# EAGLE schematic foxBMS_BMS-Slave_V1.00 (EAGLE 6.5.0), part 1 of 2
AUTHOR: Fraunhofer IISB foxBMS Team; REL-DATE: 2016-05-20; TITLE: foxBMS BMS-Slave; VERSION: 1.00

## Sheet 1 of 18: Overview
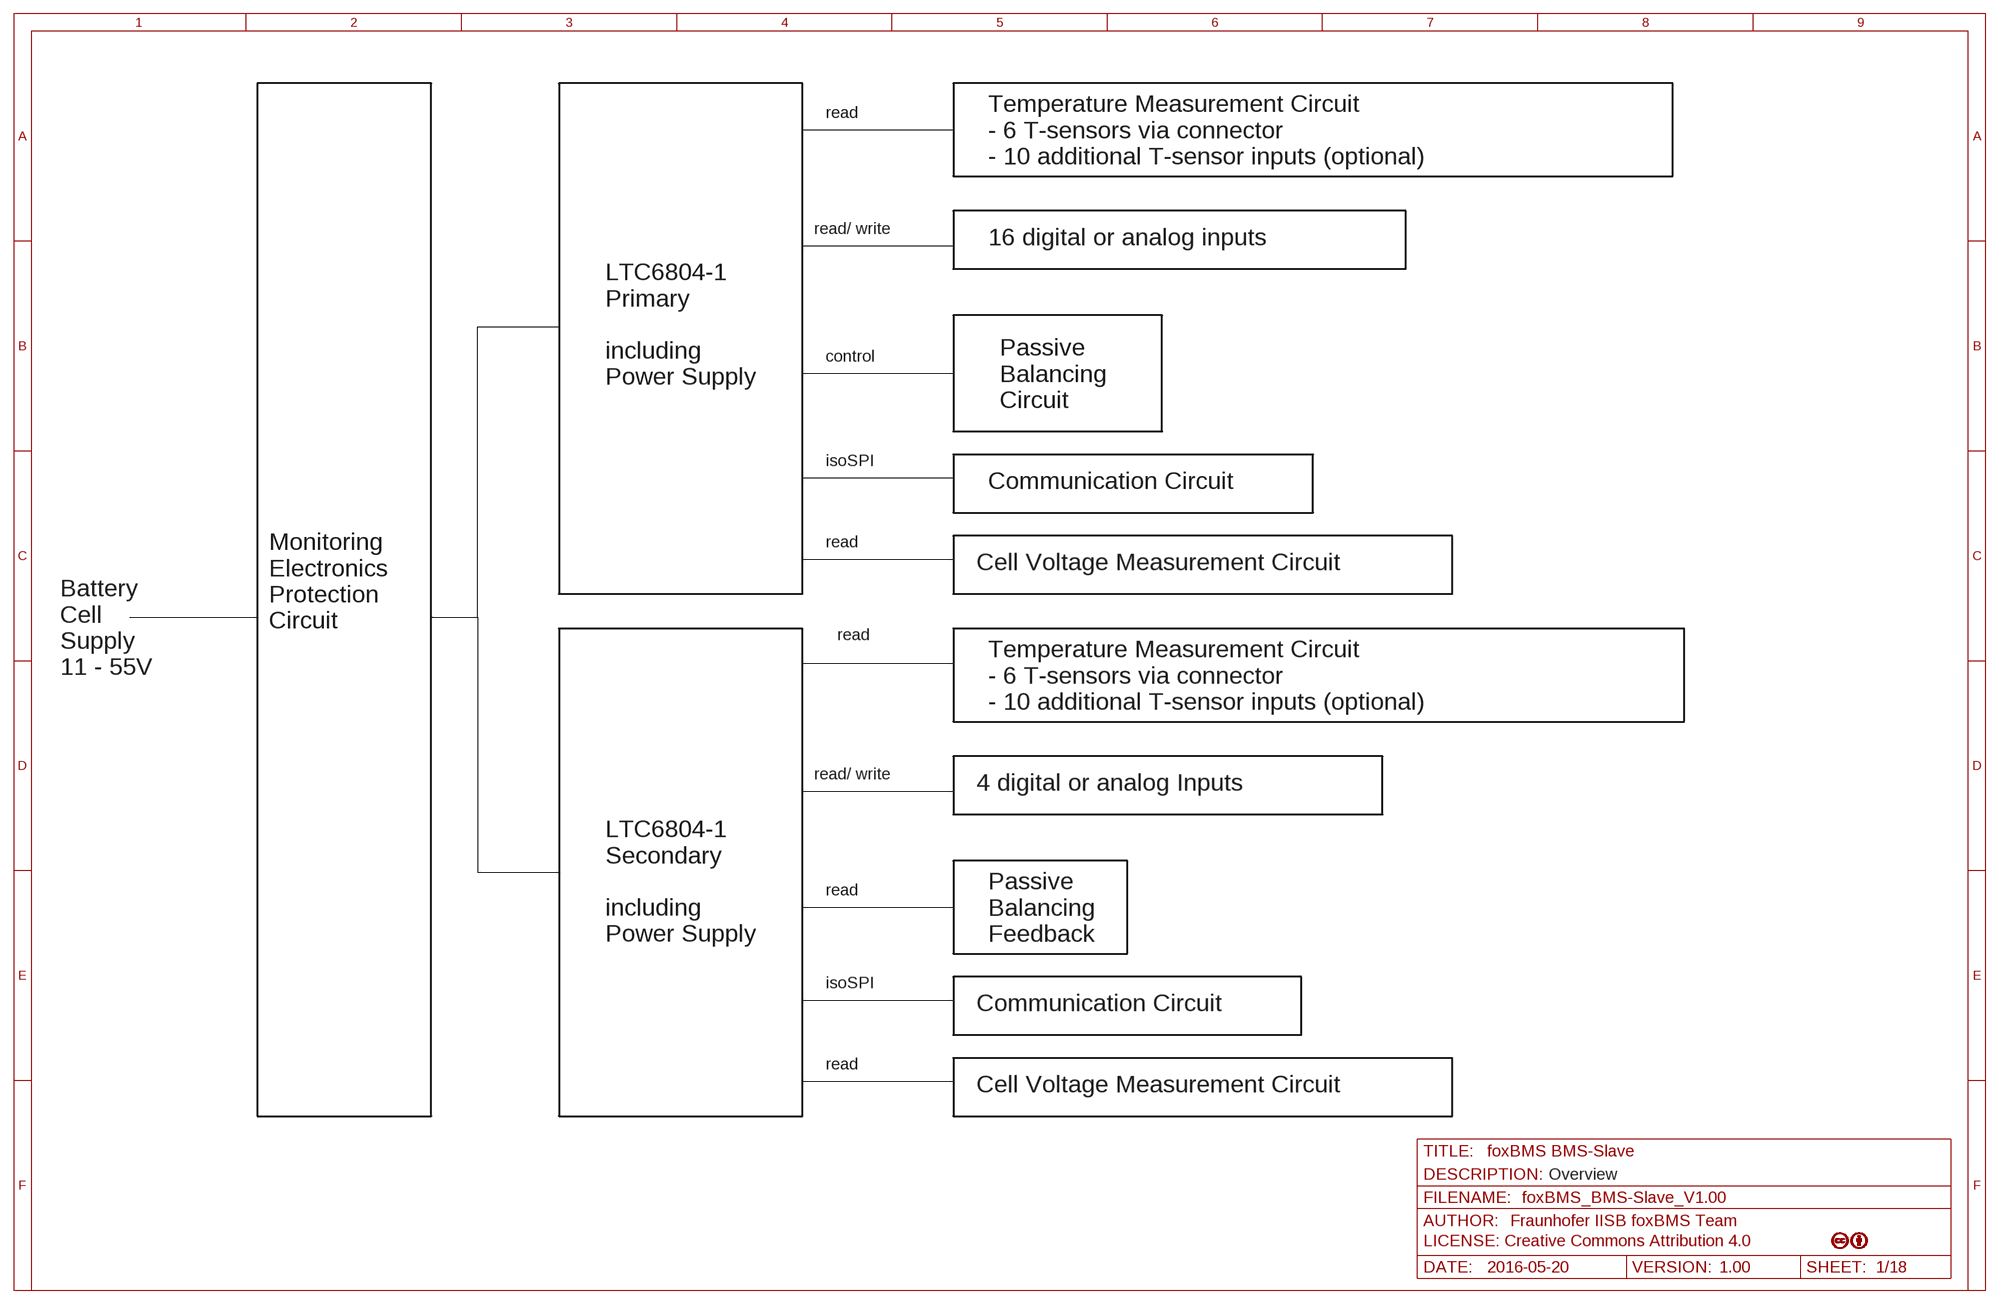
[diagram p0: schematic, sheet 1]

### Notes on the sheet
- read
- Temperature Measurement Circuit
  - 6 T-sensors via connector
  - 10 additional T-sensor inputs (optional)
- read/ write
- 16 digital or analog inputs
- control
- LTC6804-1
  Primary
  
  including 
  Power Supply
- Passive 
  Balancing 
  Circuit
- isoSPI
- Communication Circuit
- read
- Cell Voltage Measurement Circuit
- Monitoring 
  Electronics
  Protection 
  Circuit
- read
- Battery 
  Cell
  Supply
  11 - 55V
- Temperature Measurement Circuit
  - 6 T-sensors via connector
  - 10 additional T-sensor inputs (optional)
- read/ write
- 4 digital or analog Inputs
- read
- LTC6804-1
  Secondary
  
  including 
  Power Supply
- Passive 
  Balancing 
  Feedback
- isoSPI
- Communication Circuit
- read
- Cell Voltage Measurement Circuit
- Status: A
- Overview

## Sheet 2 of 18: Primary LTC6804
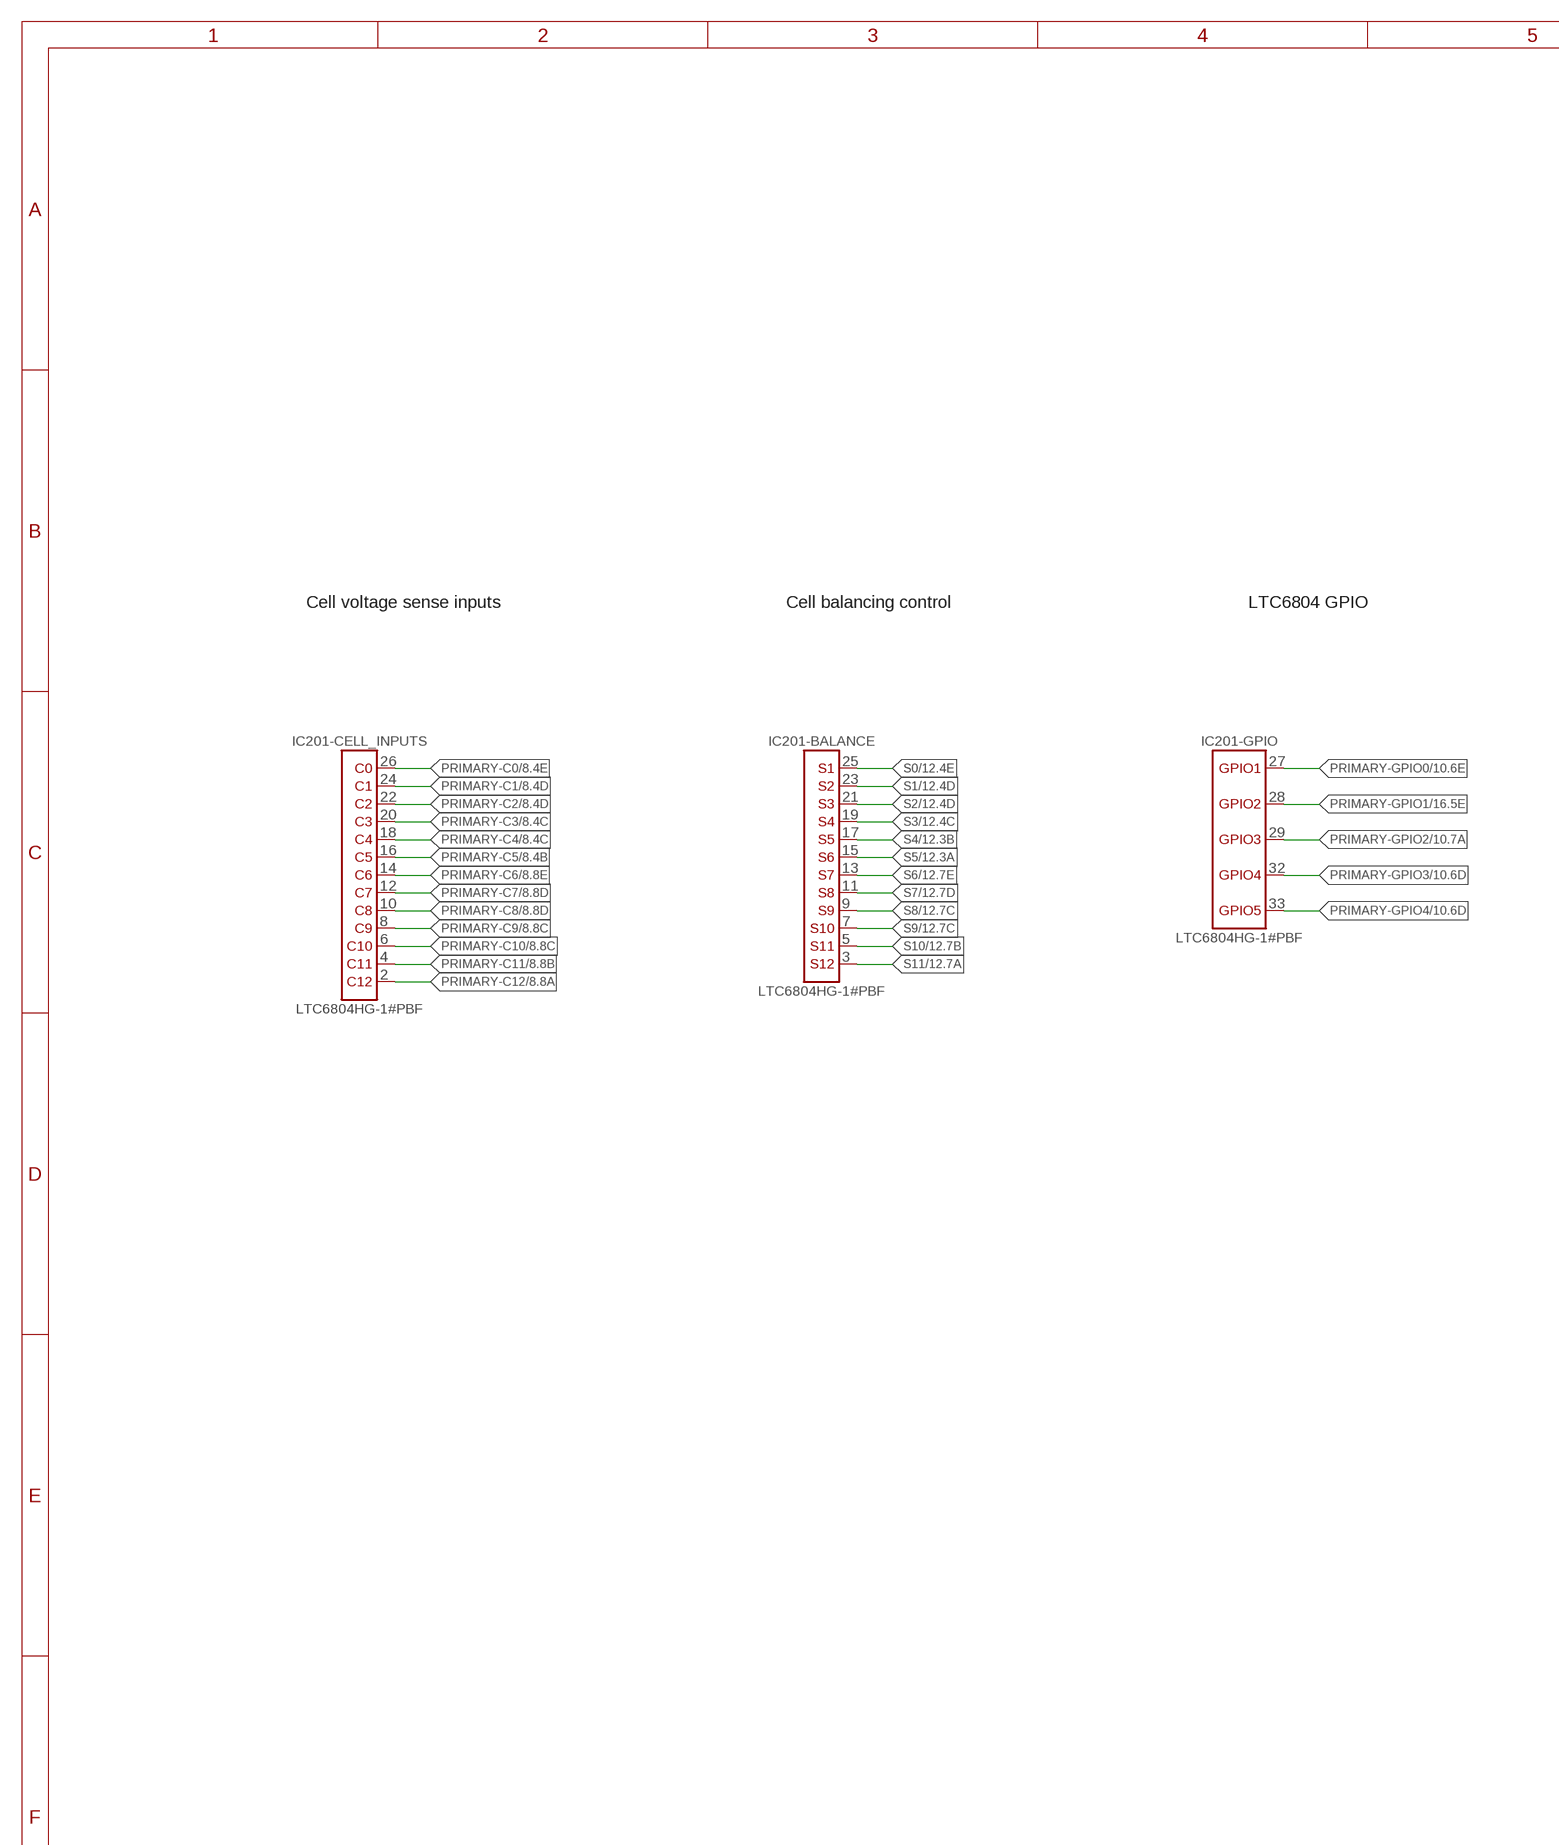
[diagram p1: schematic, sheet 2, part 1 of 2]
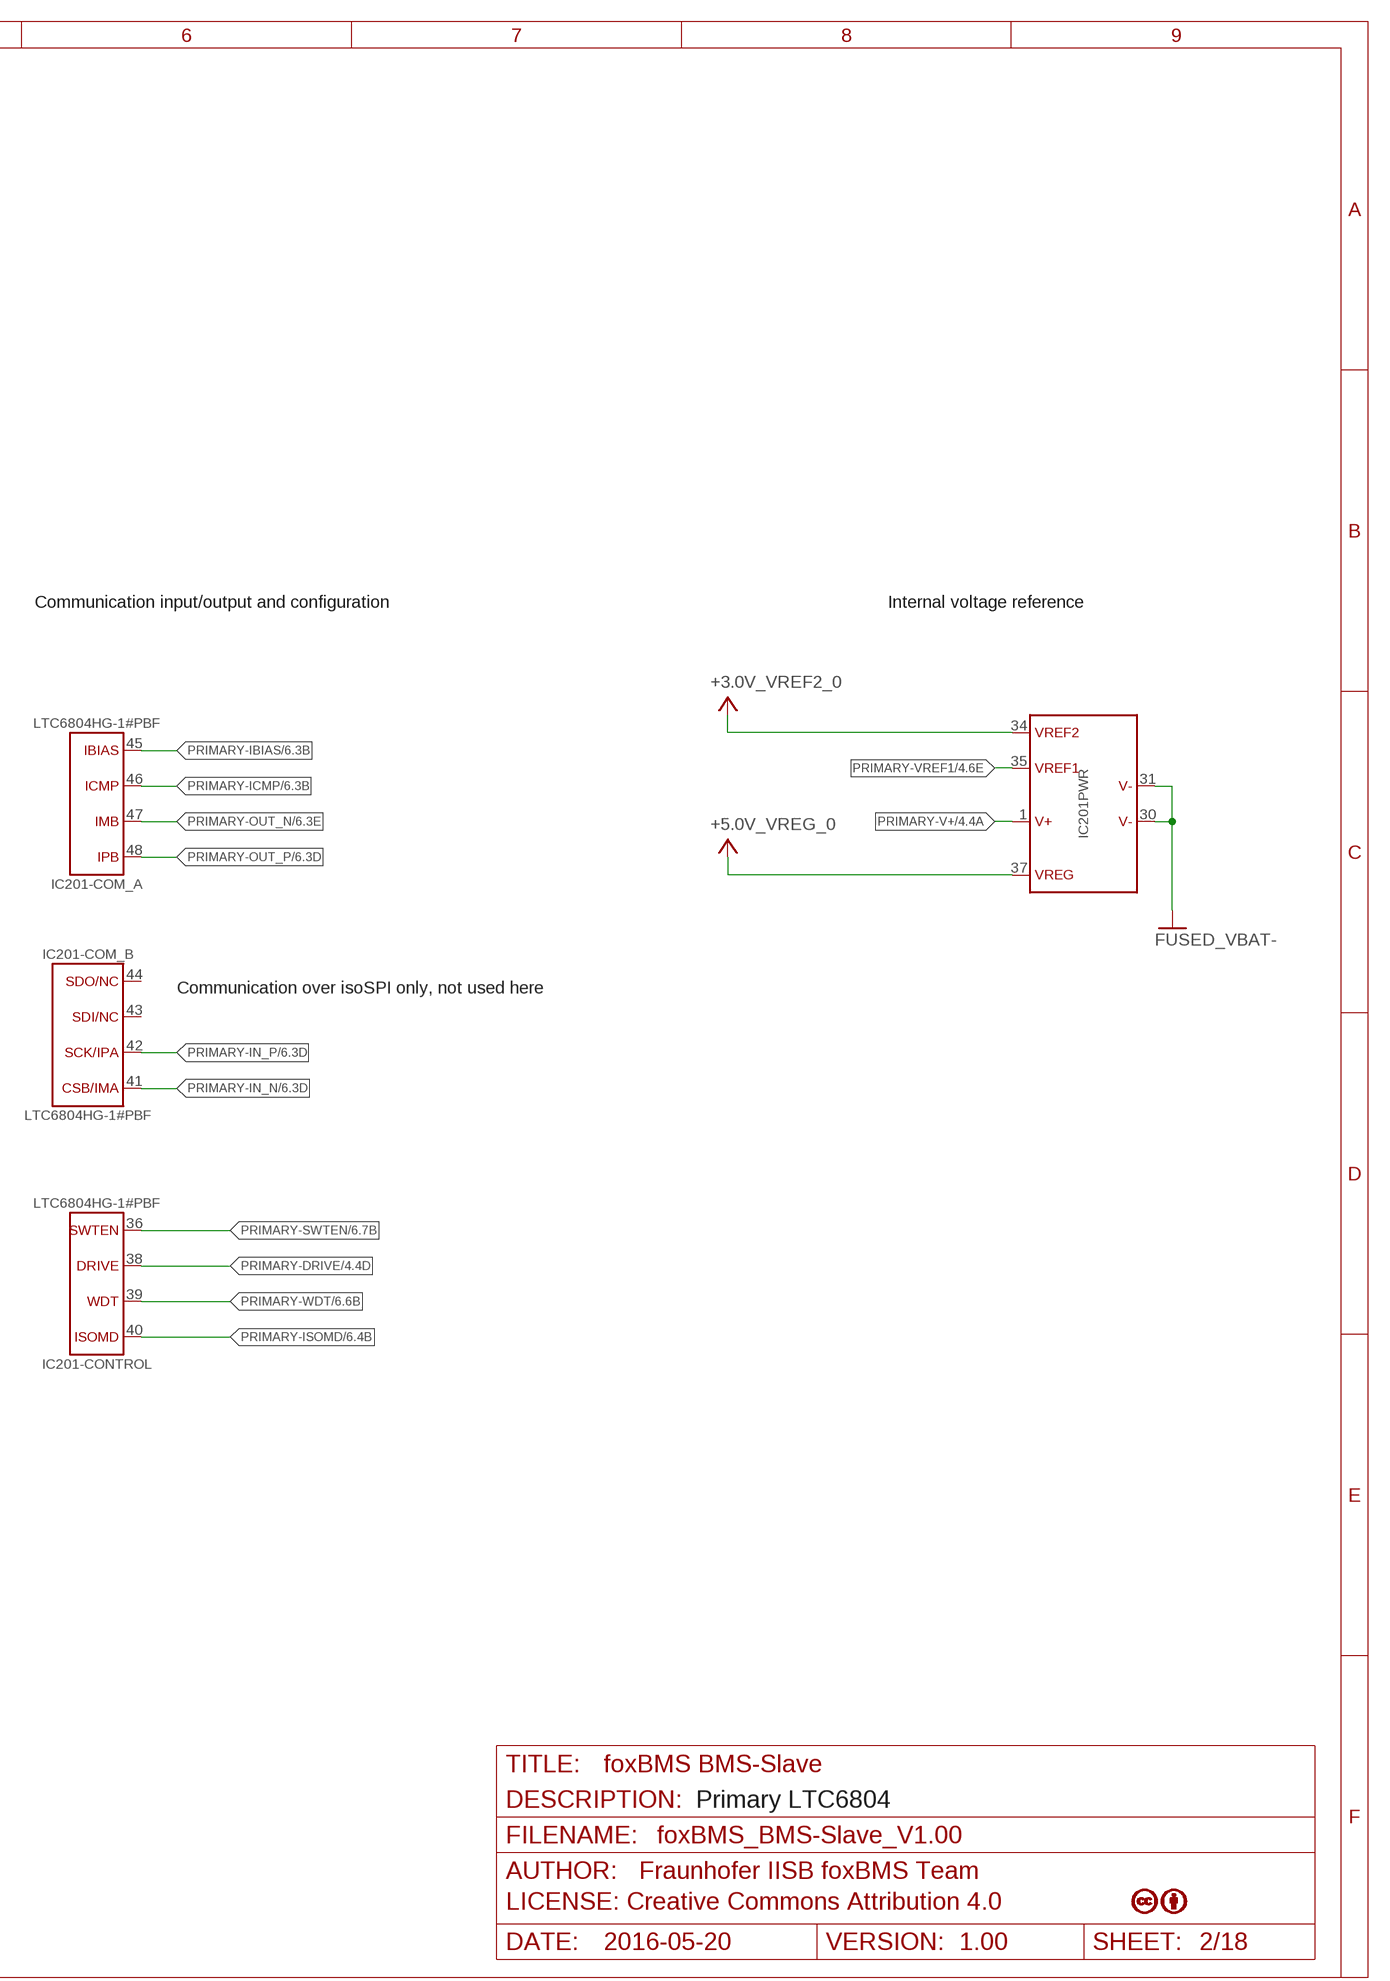
[diagram p2: schematic, sheet 2, part 2 of 2]

### Parts
IC201  LTC6804HG-1#PBF  [IC_SMD_SSOP-48_(G48)_R_LINEAR_REV01]

### Nets
+3.0V_VREF2_0: IC201.34(PWR:VREF2) ; also sheet 4,10,16
+5.0V_VREG_0: IC201.37(PWR:VREG) ; also sheet 4,6,10,13,16,17
FUSED_VBAT-: IC201.30(PWR:V-1) IC201.31(PWR:V-2) ; also sheet 3,4,5,6,7,8,9,10,11,12,13,14,15,16,17,18
PRIMARY-C0: IC201.26(-CELL_INPUTS:C0) ; also sheet 8
PRIMARY-C1: IC201.24(-CELL_INPUTS:C1) ; also sheet 8
PRIMARY-C2: IC201.22(-CELL_INPUTS:C2) ; also sheet 8
PRIMARY-C3: IC201.20(-CELL_INPUTS:C3) ; also sheet 8
PRIMARY-C4: IC201.18(-CELL_INPUTS:C4) ; also sheet 8
PRIMARY-C5: IC201.16(-CELL_INPUTS:C5) ; also sheet 8
PRIMARY-C6: IC201.14(-CELL_INPUTS:C6) ; also sheet 8
PRIMARY-C7: IC201.12(-CELL_INPUTS:C7) ; also sheet 8
PRIMARY-C8: IC201.10(-CELL_INPUTS:C8) ; also sheet 8
PRIMARY-C9: IC201.8(-CELL_INPUTS:C9) ; also sheet 8
PRIMARY-C10: IC201.6(-CELL_INPUTS:C10) ; also sheet 8
PRIMARY-C11: IC201.4(-CELL_INPUTS:C11) ; also sheet 8
PRIMARY-C12: IC201.2(-CELL_INPUTS:C12) ; also sheet 8
PRIMARY-DRIVE: IC201.38(-CONTROL:DRIVE) ; also sheet 4
PRIMARY-GPIO0: IC201.27(-GPIO:GPIO1) ; also sheet 10
PRIMARY-GPIO1: IC201.28(-GPIO:GPIO2) ; also sheet 16
PRIMARY-GPIO2: IC201.29(-GPIO:GPIO3) ; also sheet 10,16
PRIMARY-GPIO3: IC201.32(-GPIO:GPIO4) ; also sheet 10
PRIMARY-GPIO4: IC201.33(-GPIO:GPIO5) ; also sheet 10
PRIMARY-IBIAS: IC201.45(-COM_A:IBIAS) ; also sheet 6
PRIMARY-ICMP: IC201.46(-COM_A:ICMP) ; also sheet 6
PRIMARY-IN_N: IC201.41(-COM_B:CSB/IMA) ; also sheet 6
PRIMARY-IN_P: IC201.42(-COM_B:SCK/IPA) ; also sheet 6
PRIMARY-ISOMD: IC201.40(-CONTROL:ISOMD) ; also sheet 6
PRIMARY-OUT_N: IC201.47(-COM_A:IMB) ; also sheet 6
PRIMARY-OUT_P: IC201.48(-COM_A:IPB) ; also sheet 6
PRIMARY-SWTEN: IC201.36(-CONTROL:SWTEN) ; also sheet 6
PRIMARY-V+: IC201.1(PWR:V+) ; also sheet 4
PRIMARY-VREF1: IC201.35(PWR:VREF1) ; also sheet 4
PRIMARY-WDT: IC201.39(-CONTROL:WDT) ; also sheet 6,16
S0: IC201.25(-BALANCE:S1) ; also sheet 12
S1: IC201.23(-BALANCE:S2) ; also sheet 12
S2: IC201.21(-BALANCE:S3) ; also sheet 12
S3: IC201.19(-BALANCE:S4) ; also sheet 12
S4: IC201.17(-BALANCE:S5) ; also sheet 12
S5: IC201.15(-BALANCE:S6) ; also sheet 12
S6: IC201.13(-BALANCE:S7) ; also sheet 12
S7: IC201.11(-BALANCE:S8) ; also sheet 12
S8: IC201.9(-BALANCE:S9) ; also sheet 12
S9: IC201.7(-BALANCE:S10) ; also sheet 12
S10: IC201.5(-BALANCE:S11) ; also sheet 12
S11: IC201.3(-BALANCE:S12) ; also sheet 12
Unconnected: IC201.43(-COM_B:SDI/NC) IC201.44(-COM_B:SDO/NC)

### Notes on the sheet
- Cell voltage sense inputs | Cell balancing control | LTC6804 GPIO | Communication input/output and configuration | Internal voltage reference
- Communication over isoSPI only, not used here
- Status: A
- Primary LTC6804

## Sheet 3 of 18: Secondary LTC6804
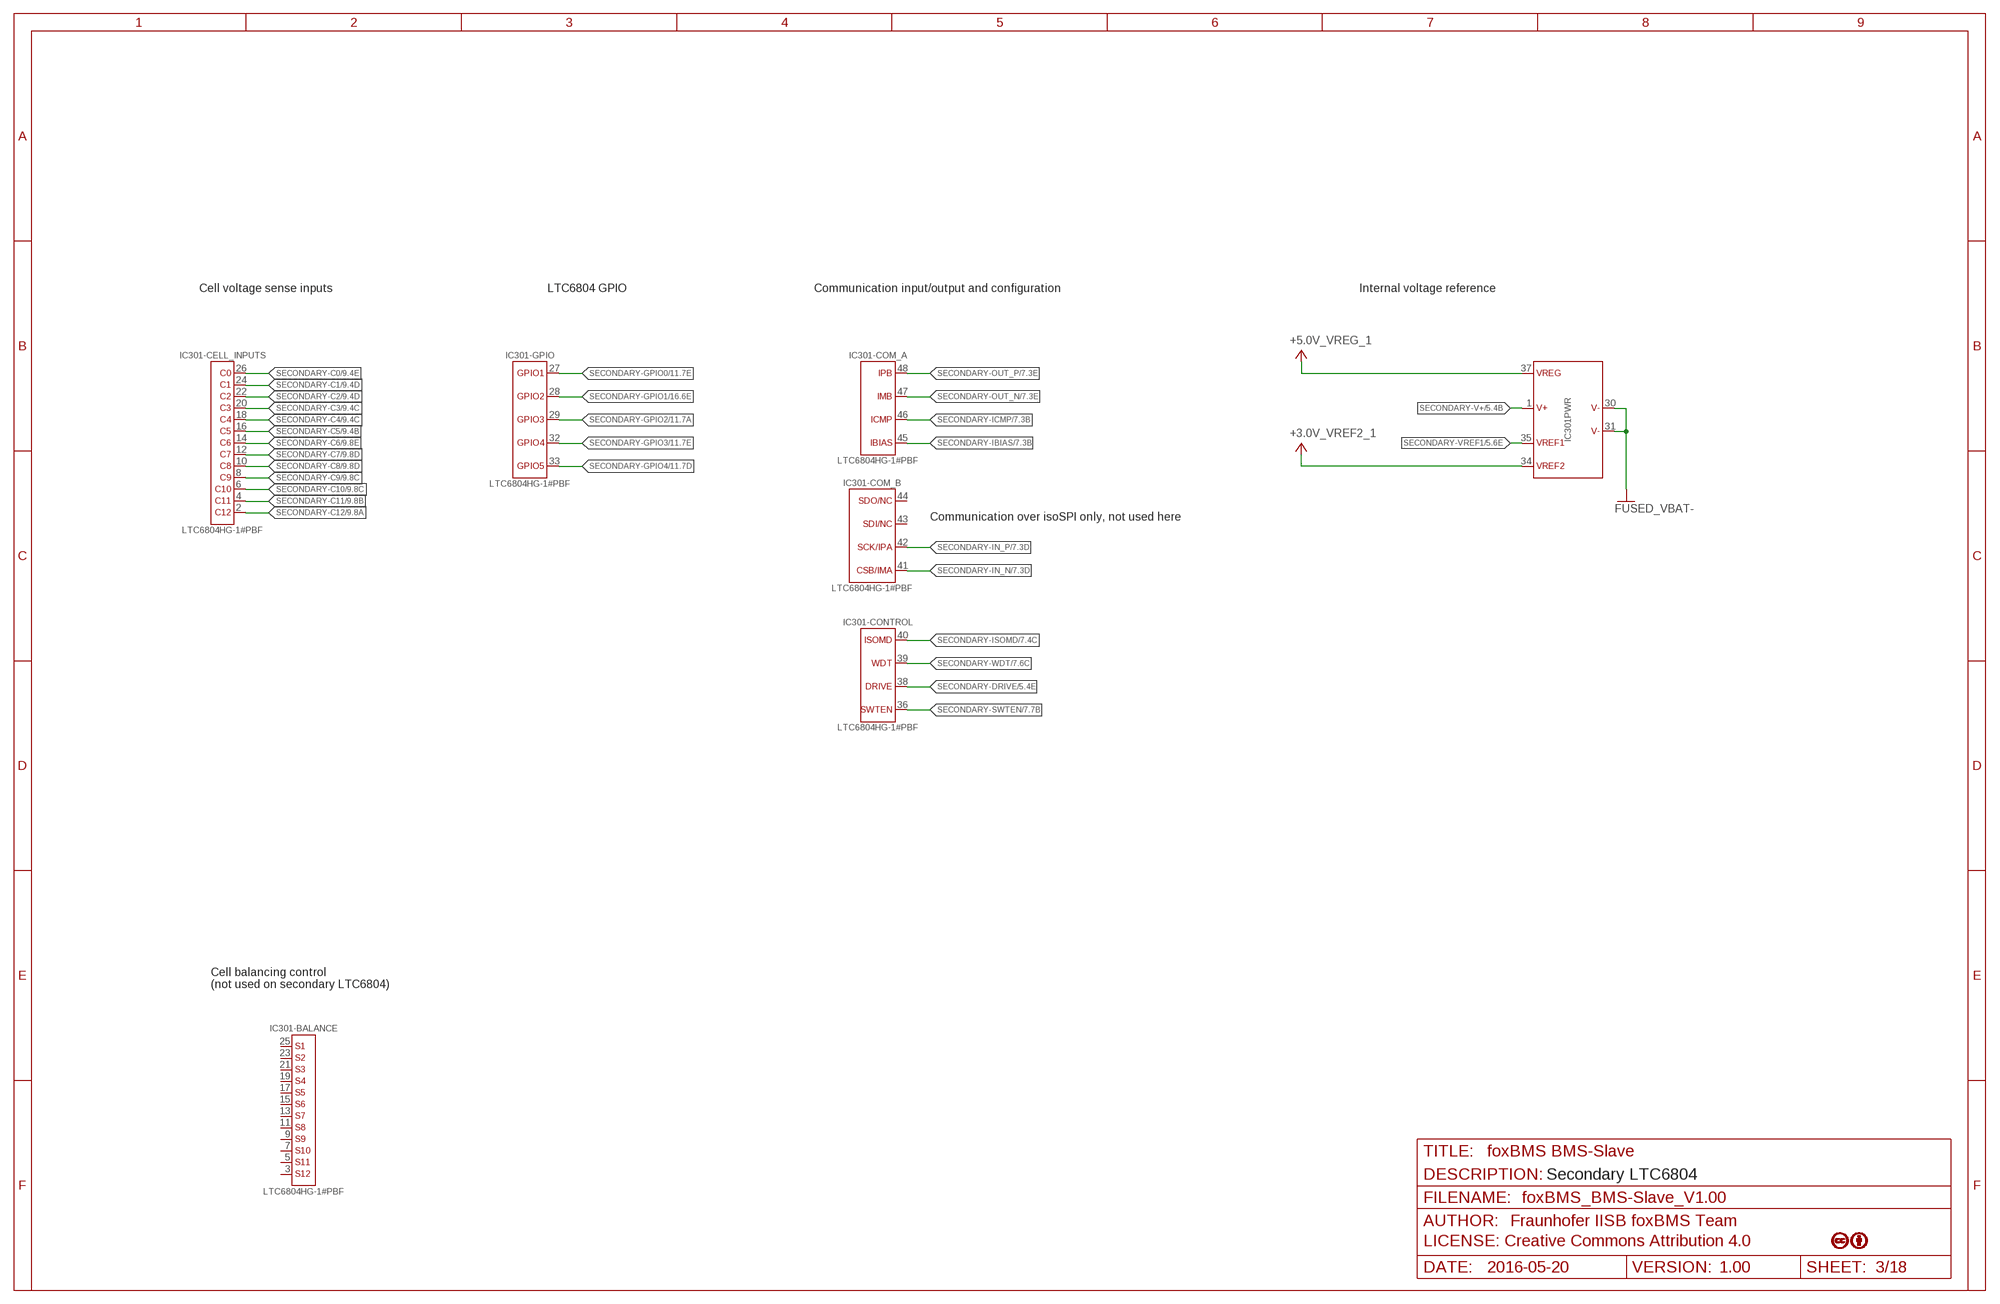
[diagram p3: schematic, sheet 3]

### Parts
IC301  LTC6804HG-1#PBF  [IC_SMD_SSOP-48_(G48)_R_LINEAR_REV01]

### Nets
+3.0V_VREF2_1: IC301.34(PWR:VREF2) ; also sheet 5,11,16
+5.0V_VREG_1: IC301.37(PWR:VREG) ; also sheet 5,7,11,14,16,18
FUSED_VBAT-: IC301.30(PWR:V-1) IC301.31(PWR:V-2) ; also sheet 2,4,5,6,7,8,9,10,11,12,13,14,15,16,17,18
SECONDARY-C0: IC301.26(-CELL_INPUTS:C0) ; also sheet 9
SECONDARY-C1: IC301.24(-CELL_INPUTS:C1) ; also sheet 9
SECONDARY-C2: IC301.22(-CELL_INPUTS:C2) ; also sheet 9
SECONDARY-C3: IC301.20(-CELL_INPUTS:C3) ; also sheet 9
SECONDARY-C4: IC301.18(-CELL_INPUTS:C4) ; also sheet 9
SECONDARY-C5: IC301.16(-CELL_INPUTS:C5) ; also sheet 9
SECONDARY-C6: IC301.14(-CELL_INPUTS:C6) ; also sheet 9
SECONDARY-C7: IC301.12(-CELL_INPUTS:C7) ; also sheet 9
SECONDARY-C8: IC301.10(-CELL_INPUTS:C8) ; also sheet 9
SECONDARY-C9: IC301.8(-CELL_INPUTS:C9) ; also sheet 9
SECONDARY-C10: IC301.6(-CELL_INPUTS:C10) ; also sheet 9
SECONDARY-C11: IC301.4(-CELL_INPUTS:C11) ; also sheet 9
SECONDARY-C12: IC301.2(-CELL_INPUTS:C12) ; also sheet 9
SECONDARY-DRIVE: IC301.38(-CONTROL:DRIVE) ; also sheet 5
SECONDARY-GPIO0: IC301.27(-GPIO:GPIO1) ; also sheet 11
SECONDARY-GPIO1: IC301.28(-GPIO:GPIO2) ; also sheet 16
SECONDARY-GPIO2: IC301.29(-GPIO:GPIO3) ; also sheet 11,16
SECONDARY-GPIO3: IC301.32(-GPIO:GPIO4) ; also sheet 11
SECONDARY-GPIO4: IC301.33(-GPIO:GPIO5) ; also sheet 11
SECONDARY-IBIAS: IC301.45(-COM_A:IBIAS) ; also sheet 7
SECONDARY-ICMP: IC301.46(-COM_A:ICMP) ; also sheet 7
SECONDARY-IN_N: IC301.41(-COM_B:CSB/IMA) ; also sheet 7
SECONDARY-IN_P: IC301.42(-COM_B:SCK/IPA) ; also sheet 7
SECONDARY-ISOMD: IC301.40(-CONTROL:ISOMD) ; also sheet 7
SECONDARY-OUT_N [DiffPair]: IC301.47(-COM_A:IMB) ; also sheet 7
SECONDARY-OUT_P [DiffPair]: IC301.48(-COM_A:IPB) ; also sheet 7
SECONDARY-SWTEN: IC301.36(-CONTROL:SWTEN) ; also sheet 7
SECONDARY-V+: IC301.1(PWR:V+) ; also sheet 5
SECONDARY-VREF1: IC301.35(PWR:VREF1) ; also sheet 5
SECONDARY-WDT: IC301.39(-CONTROL:WDT) ; also sheet 7,16
Unconnected: IC301.3(-BALANCE:S12) IC301.5(-BALANCE:S11) IC301.7(-BALANCE:S10) IC301.9(-BALANCE:S9) IC301.11(-BALANCE:S8) IC301.13(-BALANCE:S7) IC301.15(-BALANCE:S6) IC301.17(-BALANCE:S5) IC301.19(-BALANCE:S4) IC301.21(-BALANCE:S3) IC301.23(-BALANCE:S2) IC301.25(-BALANCE:S1) IC301.43(-COM_B:SDI/NC) IC301.44(-COM_B:SDO/NC)

### Notes on the sheet
- Cell voltage sense inputs | LTC6804 GPIO | Communication input/output and configuration | Internal voltage reference
- Communication over isoSPI only, not used here
- Cell balancing control
  (not used on secondary LTC6804)
- Status: A
- Secondary LTC6804

## Sheet 4 of 18: Primary Supply Circuit
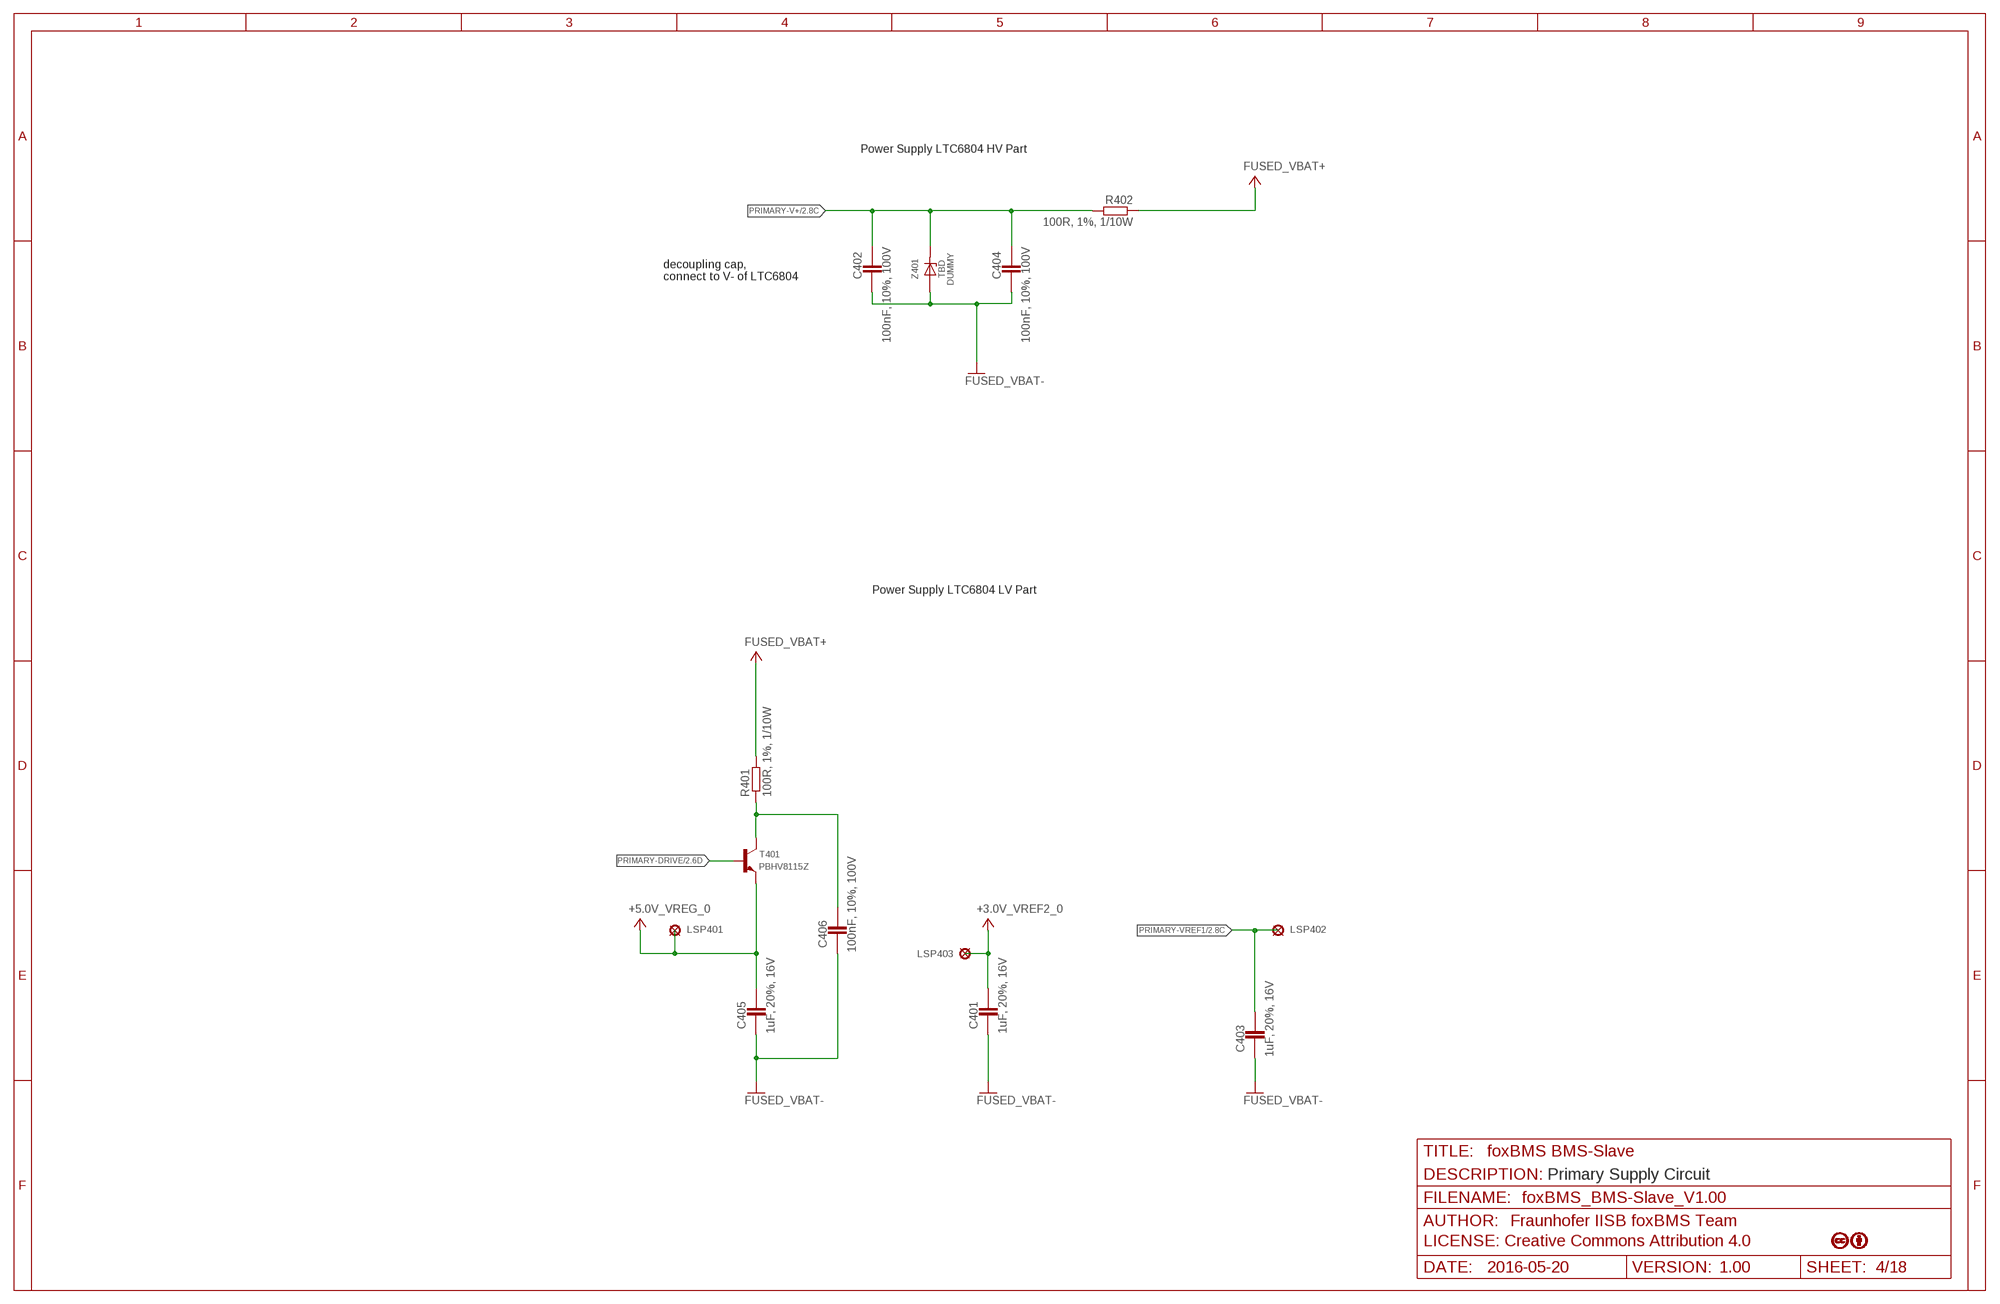
[diagram p4: schematic, sheet 4]

### Parts
C401  1uF, 20%, 16V  C_NP0_0603  [0603]
C402  100nF, 10%, 100V  C_NP0_0805  [0805]
C403  1uF, 20%, 16V  C_NP0_0603  [0603]
C404  100nF, 10%, 100V  C_NP0_0805  [0805]
C405  1uF, 20%, 16V  C_NP0_0603  [0603]
C406  100nF, 10%, 100V  C_NP0_0805  [0805]
LSP401  PAD_2.0X1.5MM  [PAD2.0X1.5MM]
LSP402  PAD_2.0X1.5MM  [PAD2.0X1.5MM]
LSP403  PAD_2.0X1.5MM  [PAD2.0X1.5MM]
R401  100R, 1%, 1/10W  R_MET_0603  [0603]
R402  100R, 1%, 1/10W  R_MET_0603  [0603]
T401  PBHV8115Z  [D_SMD_SOT223_(SC-73)_R_NXP_REV01]
Z401  60V,500mW  MMSZ4XXX_T1G-DUMMY  [D_SMD_SOD-123_R_ON_REV01]

### Nets
+3.0V_VREF2_0: C401.2 LSP403.P$1(MP) ; also sheet 2,10,16
+5.0V_VREG_0: C405.2 LSP401.P$1(MP) T401.3(E) ; also sheet 2,6,10,13,16,17
FUSED_VBAT+: R401.2 R402.1 ; also sheet 5,15
FUSED_VBAT-: C401.1 C402.2 C403.1 C404.2 C405.1 C406.1 Z401.A ; also sheet 2,3,5,6,7,8,9,10,11,12,13,14,15,16,17,18
N$5: C406.2 R401.1 T401.2(C) T401.4(C)
PRIMARY-DRIVE: T401.1(B) ; also sheet 2
PRIMARY-V+: C402.1 C404.1 R402.2 Z401.K(C) ; also sheet 2
PRIMARY-VREF1: C403.2 LSP402.P$1(MP) ; also sheet 2

### Notes on the sheet
- Power Supply LTC6804 HV Part
- decoupling cap, 
  connect to V- of LTC6804
- Power Supply LTC6804 LV Part
- Status: A
- Primary Supply Circuit

## Sheet 5 of 18: Secondary Supply Circuit
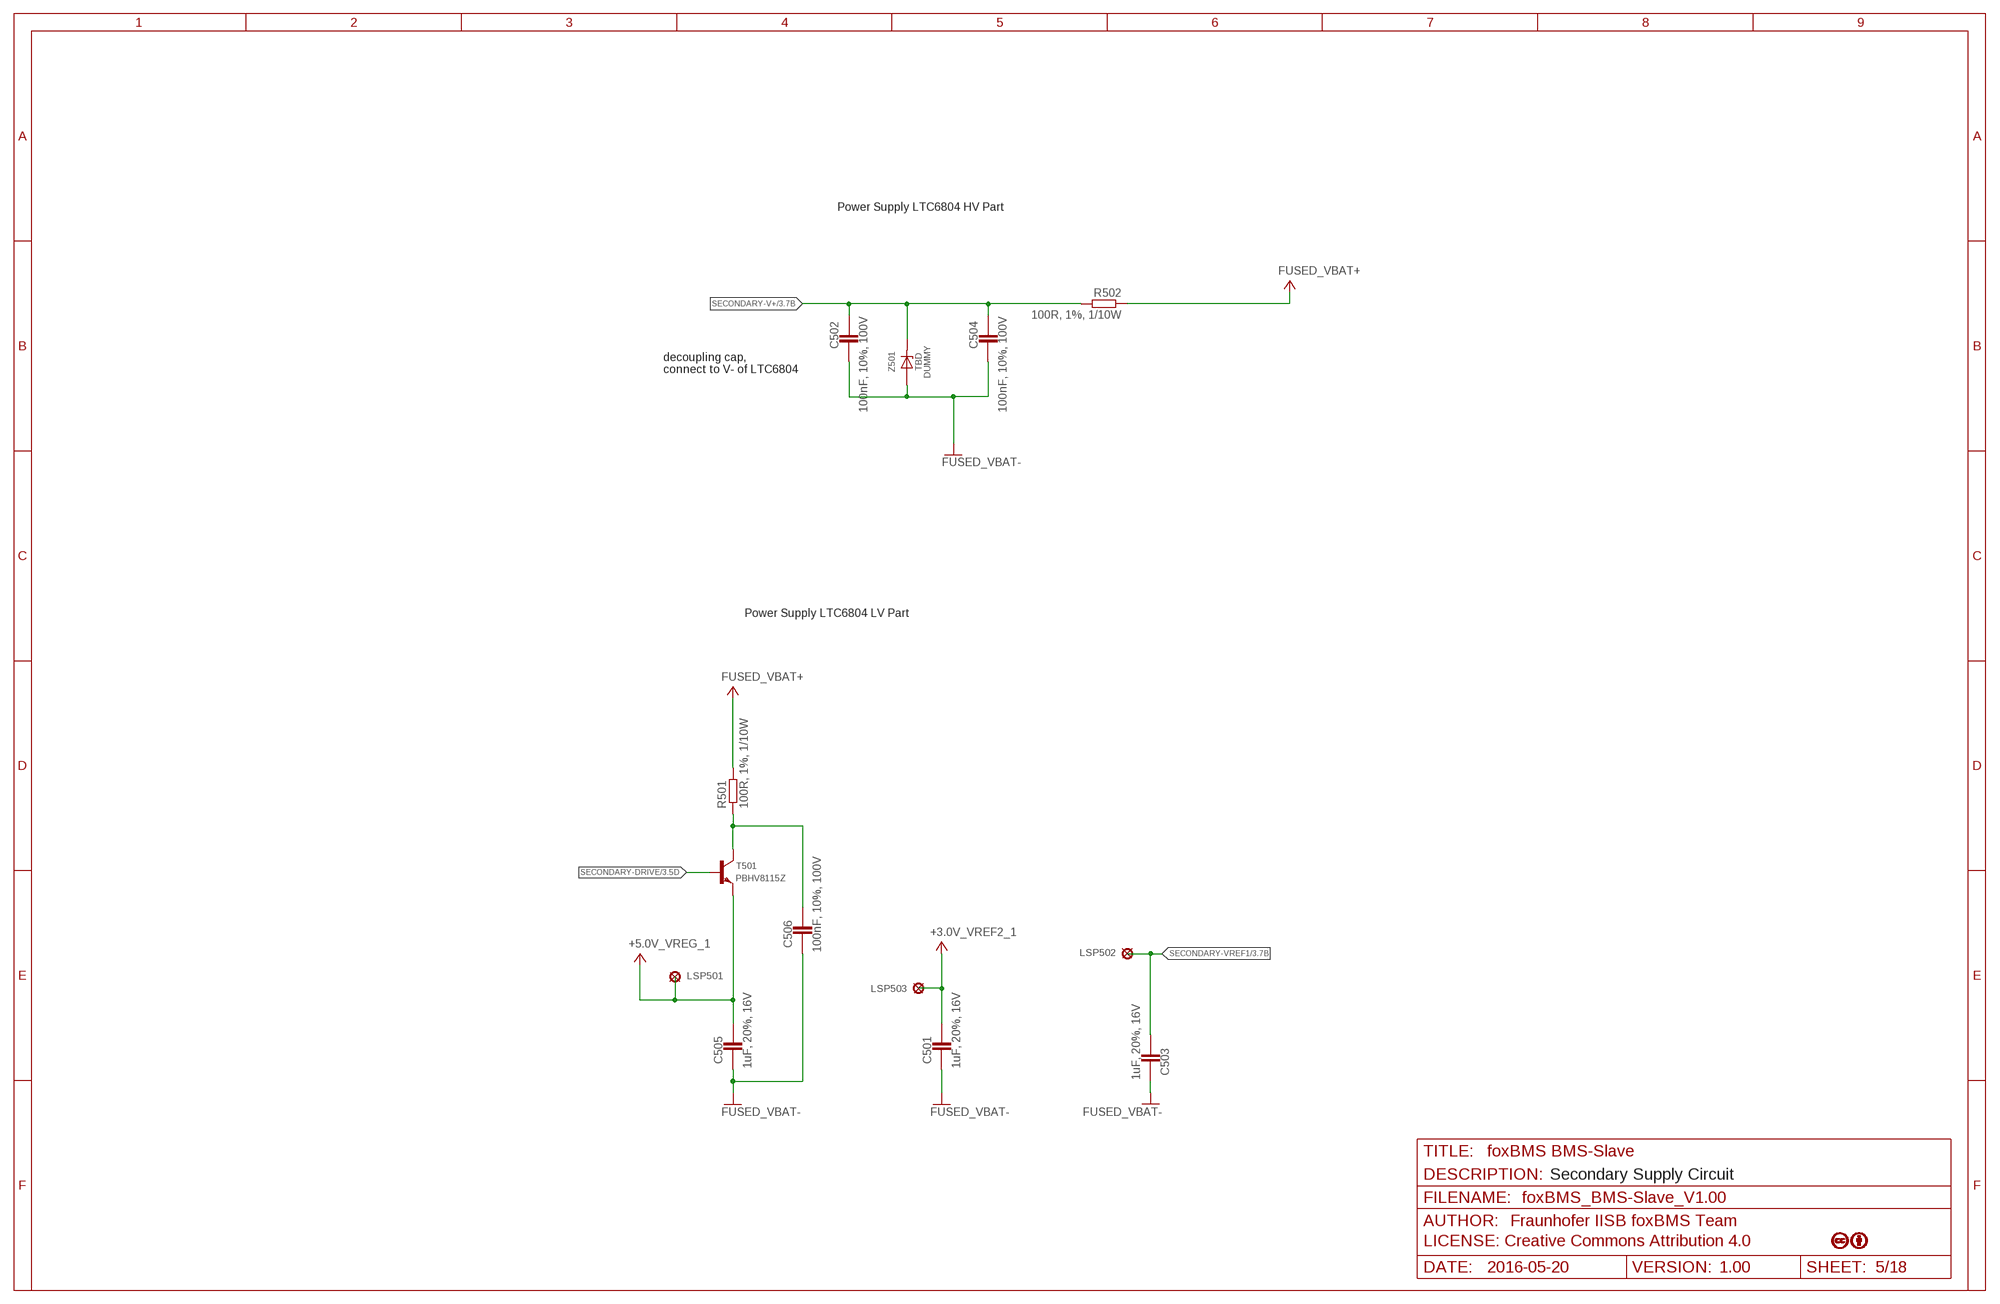
[diagram p5: schematic, sheet 5]

### Parts
C501  1uF, 20%, 16V  C_NP0_0603  [0603]
C502  100nF, 10%, 100V  C_NP0_0805  [0805]
C503  1uF, 20%, 16V  C_NP0_0603  [0603]
C504  100nF, 10%, 100V  C_NP0_0805  [0805]
C505  1uF, 20%, 16V  C_NP0_0603  [0603]
C506  100nF, 10%, 100V  C_NP0_0805  [0805]
LSP501  PAD_2.0X1.5MM  [PAD2.0X1.5MM]
LSP502  PAD_2.0X1.5MM  [PAD2.0X1.5MM]
LSP503  PAD_2.0X1.5MM  [PAD2.0X1.5MM]
R501  100R, 1%, 1/10W  R_MET_0603  [0603]
R502  100R, 1%, 1/10W  R_MET_0603  [0603]
T501  PBHV8115Z  [D_SMD_SOT223_(SC-73)_R_NXP_REV01]
Z501  60V,500mW  MMSZ4XXX_T1G-DUMMY  [D_SMD_SOD-123_R_ON_REV01]

### Nets
+3.0V_VREF2_1: C501.2 LSP503.P$1(MP) ; also sheet 3,11,16
+5.0V_VREG_1: C505.2 LSP501.P$1(MP) T501.3(E) ; also sheet 3,7,11,14,16,18
FUSED_VBAT+: R501.2 R502.1 ; also sheet 4,15
FUSED_VBAT-: C501.1 C502.2 C503.1 C504.2 C505.1 C506.1 Z501.A ; also sheet 2,3,4,6,7,8,9,10,11,12,13,14,15,16,17,18
N$13: C506.2 R501.1 T501.2(C) T501.4(C)
SECONDARY-DRIVE: T501.1(B) ; also sheet 3
SECONDARY-V+: C502.1 C504.1 R502.2 Z501.K(C) ; also sheet 3
SECONDARY-VREF1: C503.2 LSP502.P$1(MP) ; also sheet 3

### Notes on the sheet
- Power Supply LTC6804 HV Part
- decoupling cap, 
  connect to V- of LTC6804
- Power Supply LTC6804 LV Part
- Status: A
- Secondary Supply Circuit

## Sheet 6 of 18: Primary Communication Circuit
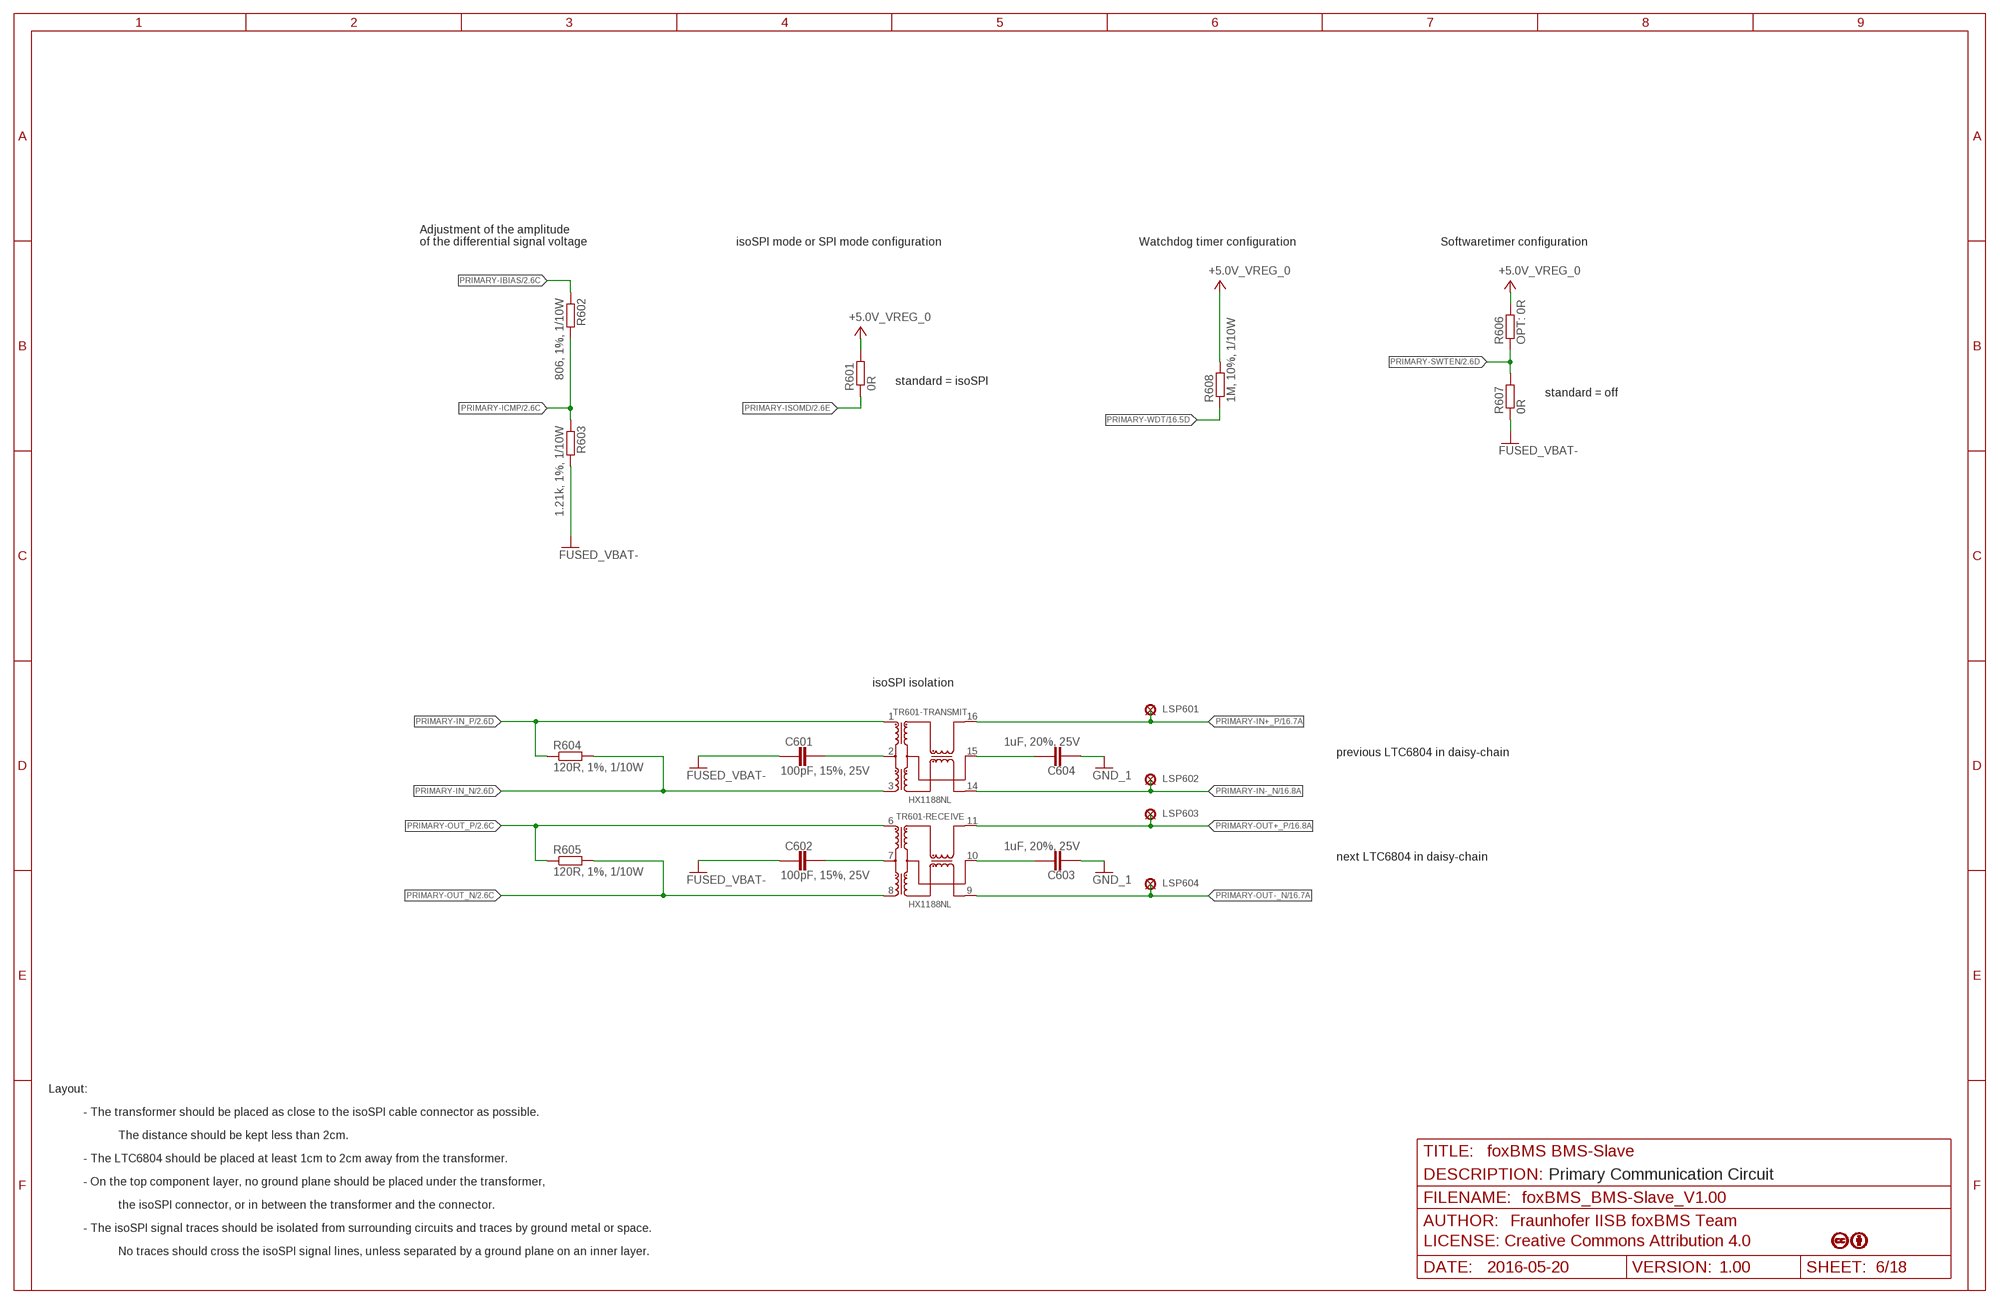
[diagram p6: schematic, sheet 6]

### Parts
C601  100pF, 15%, 25V  C_NP0_0603  [0603]
C602  100pF, 15%, 25V  C_NP0_0603  [0603]
C603  1uF, 20%, 25V  C_NP0_0603  [0603]
C604  1uF, 20%, 25V  C_NP0_0603  [0603]
LSP601  PAD_2.0X1.5MM  [PAD2.0X1.5MM]
LSP602  PAD_2.0X1.5MM  [PAD2.0X1.5MM]
LSP603  PAD_2.0X1.5MM  [PAD2.0X1.5MM]
LSP604  PAD_2.0X1.5MM  [PAD2.0X1.5MM]
R601  0R  R_MET_0603  [0603]
R602  806, 1%, 1/10W  R_MET_0603  [0603]
R603  1.21k, 1%, 1/10W  R_MET_0603  [0603]
R604  120R, 1%, 1/10W  R_MET_0603  [0603]
R605  120R, 1%, 1/10W  R_MET_0603  [0603]
R606  OPT: 0R  R_MET_0603  [0603]
R607  0R  R_MET_0603  [0603]
R608  1M, 10%, 1/10W  R_MET_0603  [0603]
TR601  HX1188NL  [TR_SMD_SOIC-16_(12,70MMX9,53MMX5,97MM)_R_PULSE_REV01]

### Nets
+5.0V_VREG_0: R601.2 R606.2 R608.2 ; also sheet 2,4,10,13,16,17
FUSED_VBAT-: C601.1 C602.1 R603.2 R607.1 ; also sheet 2,3,4,5,7,8,9,10,11,12,13,14,15,16,17,18
GND_1: C603.1 C604.1 ; also sheet 7
N$10: C601.2 TR601.2(-TRANSMIT:CT)
N$12: C602.2 TR601.7(-RECEIVE:CT)
N$18: C604.2 TR601.15(-TRANSMIT:CMT)
N$23: C603.2 TR601.10(-RECEIVE:CMT)
PRIMARY-IBIAS: R602.1 ; also sheet 2
PRIMARY-ICMP: R602.2 R603.1 ; also sheet 2
PRIMARY-IN+_P: LSP601.P$1(MP) TR601.16(-TRANSMIT:X+) ; also sheet 16
PRIMARY-IN-_N: LSP602.P$1(MP) TR601.14(-TRANSMIT:X-) ; also sheet 16
PRIMARY-IN_N: R604.2 TR601.3(-TRANSMIT:D-) ; also sheet 2
PRIMARY-IN_P: R604.1 TR601.1(-TRANSMIT:D+) ; also sheet 2
PRIMARY-ISOMD: R601.1 ; also sheet 2
PRIMARY-OUT+_P: LSP603.P$1(MP) TR601.11(-RECEIVE:X+) ; also sheet 16
PRIMARY-OUT-_N: LSP604.P$1(MP) TR601.9(-RECEIVE:X-) ; also sheet 16
PRIMARY-OUT_N: R605.2 TR601.8(-RECEIVE:D-) ; also sheet 2
PRIMARY-OUT_P: R605.1 TR601.6(-RECEIVE:D+) ; also sheet 2
PRIMARY-SWTEN: R606.1 R607.2 ; also sheet 2
PRIMARY-WDT: R608.1 ; also sheet 2,16
Unconnected: TR601.4(NC1:NC) TR601.5(NC2:NC) TR601.12(NC3:NC) TR601.13(NC4:NC)

### Notes on the sheet
- Adjustment of the amplitude
  of the differential signal voltage
- isoSPI mode or SPI mode configuration | Watchdog timer configuration | Softwaretimer configuration
- standard = isoSPI
- standard = off
- isoSPI isolation
- previous LTC6804 in daisy-chain
- next LTC6804 in daisy-chain
- Layout:
- - The transformer should be placed as close to the isoSPI cable connector as possible.
- The distance should be kept less than 2cm.
- - The LTC6804 should be placed at least 1cm to 2cm away from the transformer.
- Status: A
- Primary Communication Circuit
- - On the top component layer, no ground plane should be placed under the transformer,
- the isoSPI connector, or in between the transformer and the connector.
- - The isoSPI signal traces should be isolated from surrounding circuits and traces by ground metal or space.
- No traces should cross the isoSPI signal lines, unless separated by a ground plane on an inner layer.

## Sheet 7 of 18: Secondary Communication Circuit
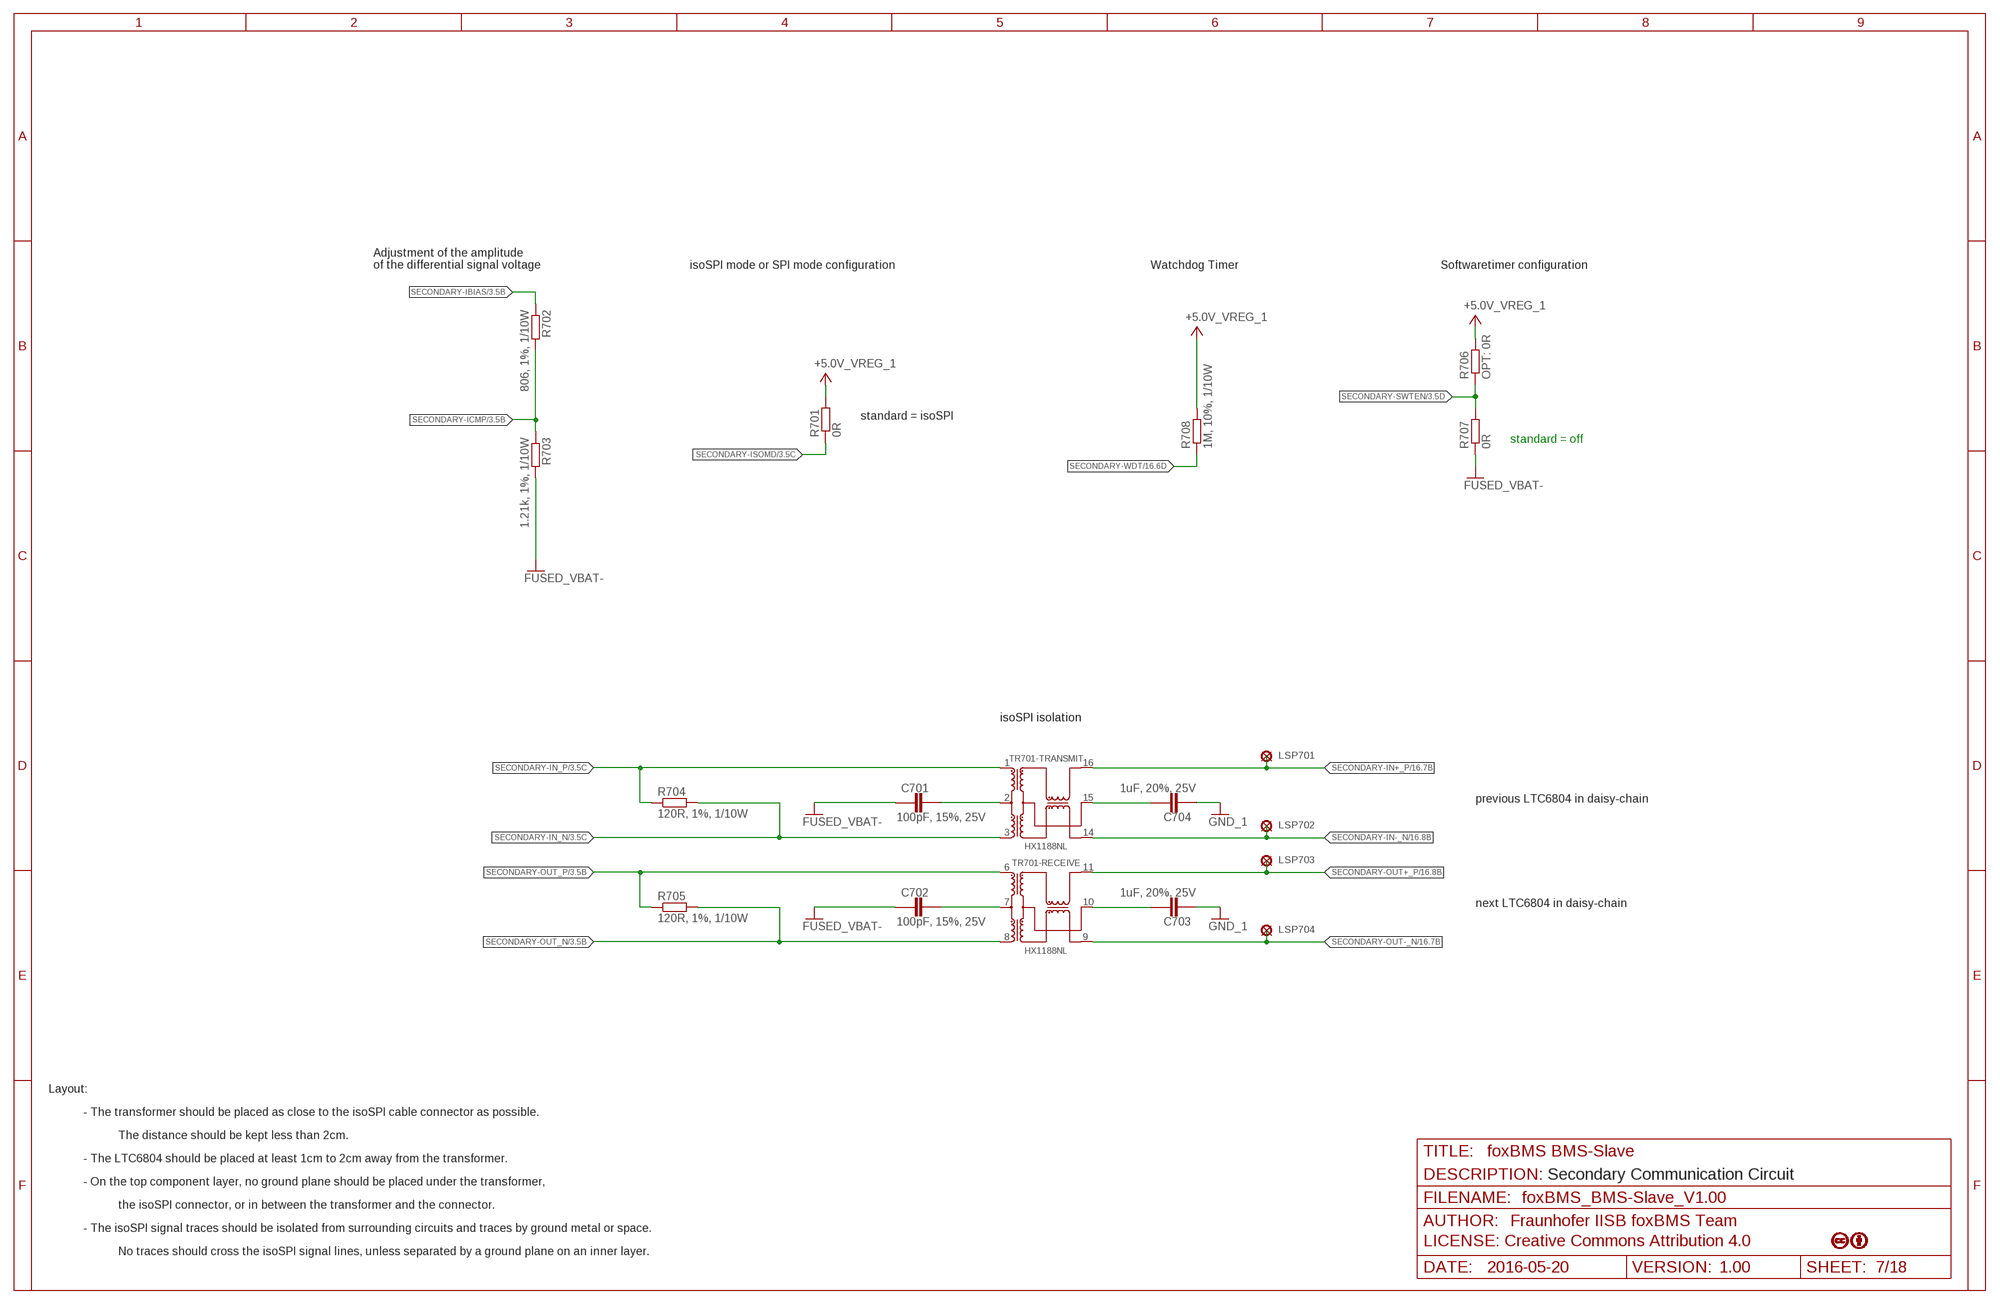
[diagram p7: schematic, sheet 7]

### Parts
C701  100pF, 15%, 25V  C_NP0_0603  [0603]
C702  100pF, 15%, 25V  C_NP0_0603  [0603]
C703  1uF, 20%, 25V  C_NP0_0603  [0603]
C704  1uF, 20%, 25V  C_NP0_0603  [0603]
LSP701  PAD_2.0X1.5MM  [PAD2.0X1.5MM]
LSP702  PAD_2.0X1.5MM  [PAD2.0X1.5MM]
LSP703  PAD_2.0X1.5MM  [PAD2.0X1.5MM]
LSP704  PAD_2.0X1.5MM  [PAD2.0X1.5MM]
R701  0R  R_MET_0603  [0603]
R702  806, 1%, 1/10W  R_MET_0603  [0603]
R703  1.21k, 1%, 1/10W  R_MET_0603  [0603]
R704  120R, 1%, 1/10W  R_MET_0603  [0603]
R705  120R, 1%, 1/10W  R_MET_0603  [0603]
R706  OPT: 0R  R_MET_0603  [0603]
R707  0R  R_MET_0603  [0603]
R708  1M, 10%, 1/10W  R_MET_0603  [0603]
TR701  HX1188NL  [TR_SMD_SOIC-16_(12,70MMX9,53MMX5,97MM)_R_PULSE_REV01]

### Nets
+5.0V_VREG_1: R701.2 R706.2 R708.2 ; also sheet 3,5,11,14,16,18
FUSED_VBAT-: C701.1 C702.1 R703.2 R707.1 ; also sheet 2,3,4,5,6,8,9,10,11,12,13,14,15,16,17,18
GND_1: C703.1 C704.1 ; also sheet 6
N$38: C701.2 TR701.2(-TRANSMIT:CT)
N$40: C702.2 TR701.7(-RECEIVE:CT)
N$41: C704.2 TR701.15(-TRANSMIT:CMT)
N$44: C703.2 TR701.10(-RECEIVE:CMT)
SECONDARY-IBIAS: R702.1 ; also sheet 3
SECONDARY-ICMP: R702.2 R703.1 ; also sheet 3
SECONDARY-IN+_P: LSP701.P$1(MP) TR701.16(-TRANSMIT:X+) ; also sheet 16
SECONDARY-IN-_N: LSP702.P$1(MP) TR701.14(-TRANSMIT:X-) ; also sheet 16
SECONDARY-IN_N: R704.2 TR701.3(-TRANSMIT:D-) ; also sheet 3
SECONDARY-IN_P: R704.1 TR701.1(-TRANSMIT:D+) ; also sheet 3
SECONDARY-ISOMD: R701.1 ; also sheet 3
SECONDARY-OUT+_P: LSP703.P$1(MP) TR701.11(-RECEIVE:X+) ; also sheet 16
SECONDARY-OUT-_N: LSP704.P$1(MP) TR701.9(-RECEIVE:X-) ; also sheet 16
SECONDARY-OUT_N [DiffPair]: R705.2 TR701.8(-RECEIVE:D-) ; also sheet 3
SECONDARY-OUT_P [DiffPair]: R705.1 TR701.6(-RECEIVE:D+) ; also sheet 3
SECONDARY-SWTEN: R706.1 R707.2 ; also sheet 3
SECONDARY-WDT: R708.1 ; also sheet 3,16
Unconnected: TR701.4(NC1:NC) TR701.5(NC2:NC) TR701.12(NC3:NC) TR701.13(NC4:NC)

### Notes on the sheet
- Adjustment of the amplitude 
  of the differential signal voltage
- isoSPI mode or SPI mode configuration | Watchdog Timer | Softwaretimer configuration
- standard = isoSPI
- standard = off
- isoSPI isolation
- previous LTC6804 in daisy-chain
- next LTC6804 in daisy-chain
- Layout:
- - The transformer should be placed as close to the isoSPI cable connector as possible.
- The distance should be kept less than 2cm.
- - The LTC6804 should be placed at least 1cm to 2cm away from the transformer.
- Status: A
- Secondary Communication Circuit
- - On the top component layer, no ground plane should be placed under the transformer,
- the isoSPI connector, or in between the transformer and the connector.
- - The isoSPI signal traces should be isolated from surrounding circuits and traces by ground metal or space.
- No traces should cross the isoSPI signal lines, unless separated by a ground plane on an inner layer.

## Sheet 8 of 18: Primary Voltage Measurement
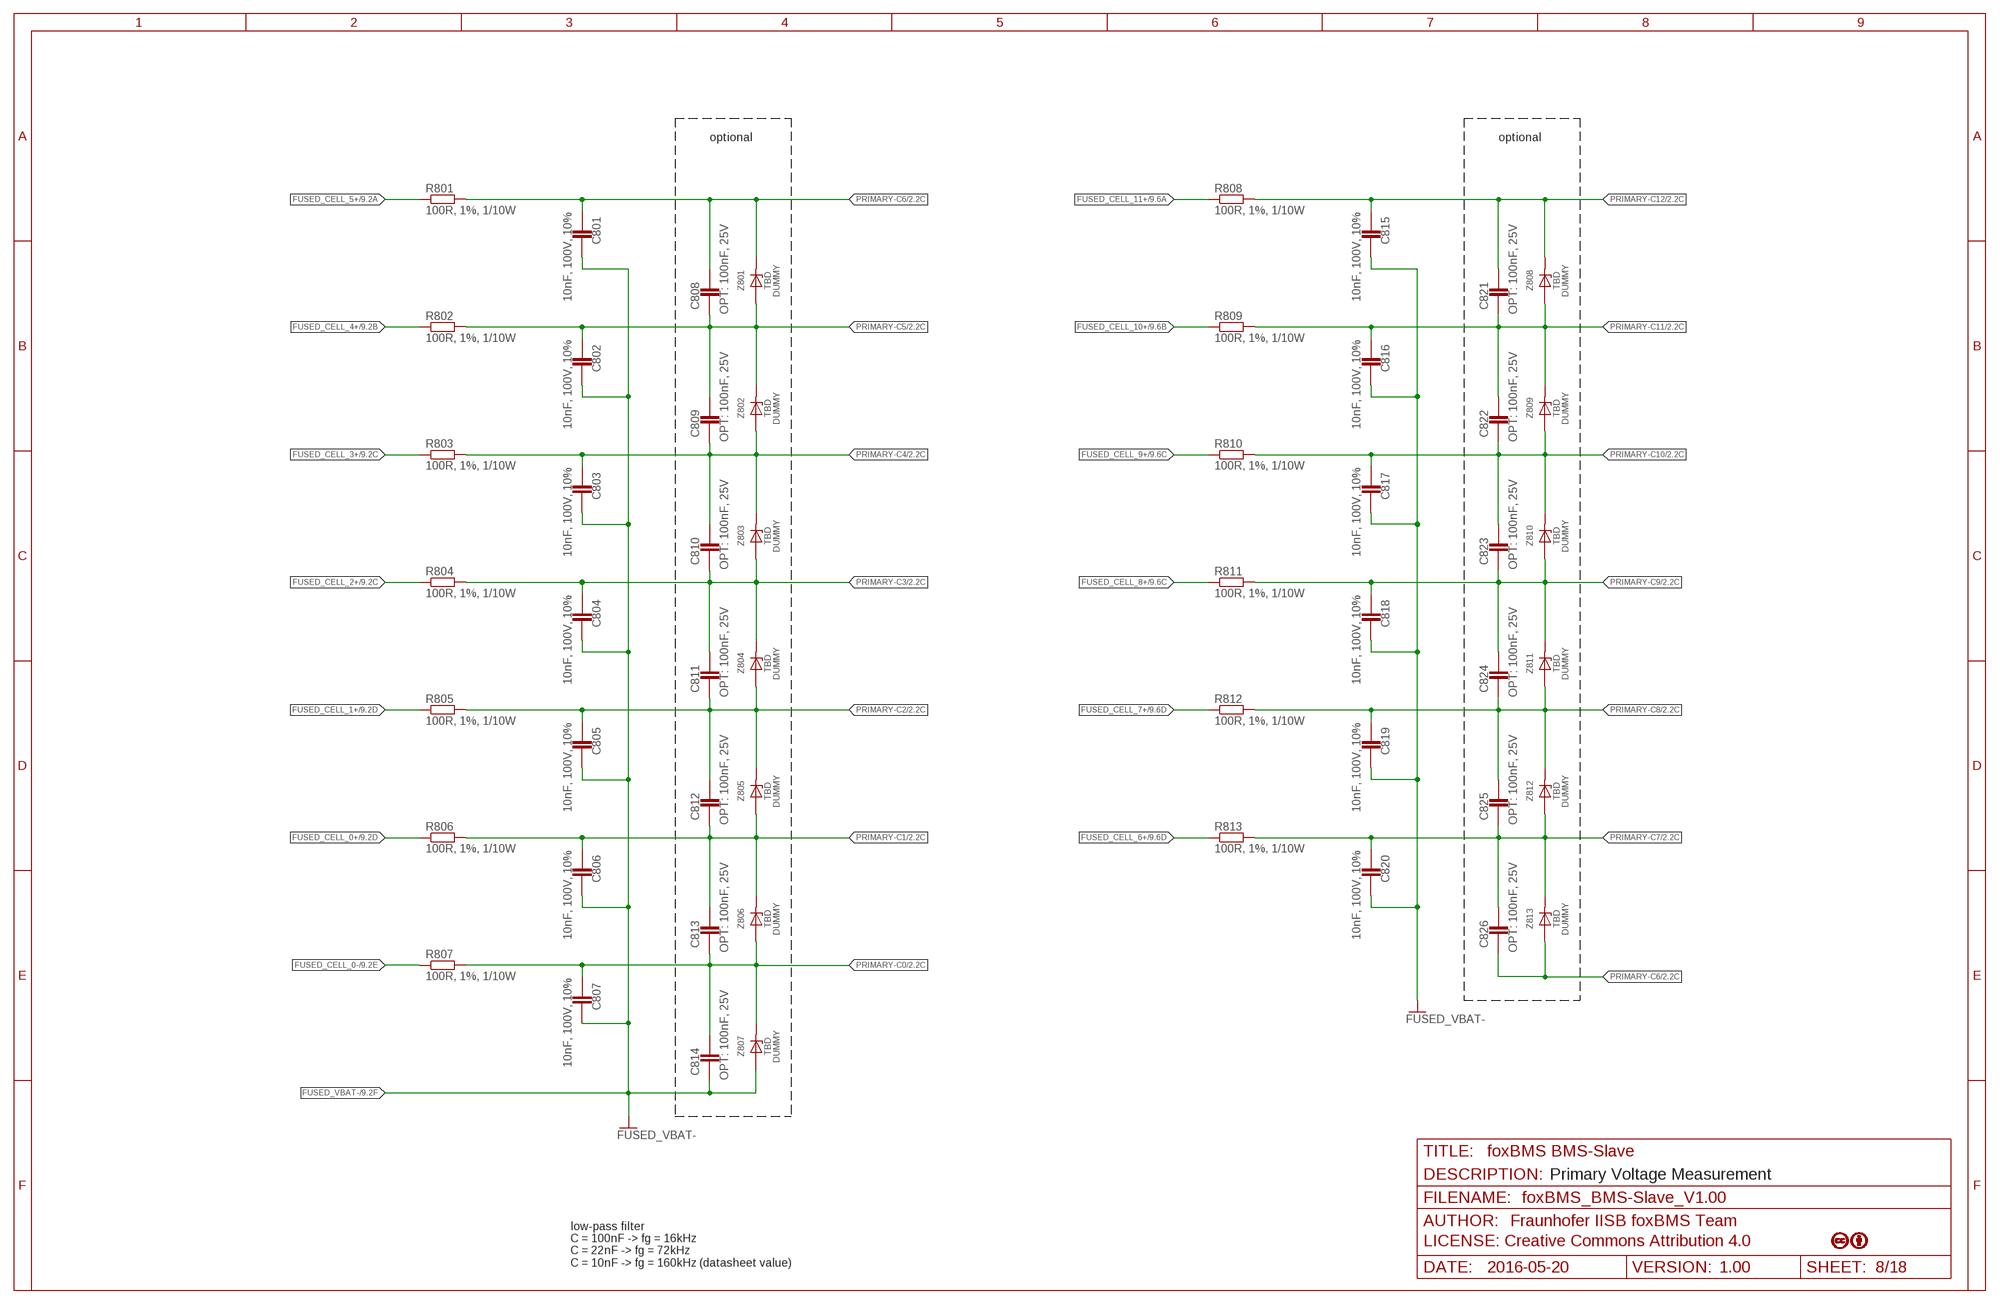
[diagram p8: schematic, sheet 8]

### Parts
C801  10nF, 100V, 10%  C_NP0_0603  [0603]
C802  10nF, 100V, 10%  C_NP0_0603  [0603]
C803  10nF, 100V, 10%  C_NP0_0603  [0603]
C804  10nF, 100V, 10%  C_NP0_0603  [0603]
C805  10nF, 100V, 10%  C_NP0_0603  [0603]
C806  10nF, 100V, 10%  C_NP0_0603  [0603]
C807  10nF, 100V, 10%  C_NP0_0603  [0603]
C808  OPT: 100nF, 25V  C_NP0_0805  [0805]
C809  OPT: 100nF, 25V  C_NP0_0805  [0805]
C810  OPT: 100nF, 25V  C_NP0_0805  [0805]
C811  OPT: 100nF, 25V  C_NP0_0805  [0805]
C812  OPT: 100nF, 25V  C_NP0_0805  [0805]
C813  OPT: 100nF, 25V  C_NP0_0805  [0805]
C814  OPT: 100nF, 25V  C_NP0_0805  [0805]
C815  10nF, 100V, 10%  C_NP0_0603  [0603]
C816  10nF, 100V, 10%  C_NP0_0603  [0603]
C817  10nF, 100V, 10%  C_NP0_0603  [0603]
C818  10nF, 100V, 10%  C_NP0_0603  [0603]
C819  10nF, 100V, 10%  C_NP0_0603  [0603]
C820  10nF, 100V, 10%  C_NP0_0603  [0603]
C821  OPT: 100nF, 25V  C_NP0_0805  [0805]
C822  OPT: 100nF, 25V  C_NP0_0805  [0805]
C823  OPT: 100nF, 25V  C_NP0_0805  [0805]
C824  OPT: 100nF, 25V  C_NP0_0805  [0805]
C825  OPT: 100nF, 25V  C_NP0_0805  [0805]
C826  OPT: 100nF, 25V  C_NP0_0805  [0805]
R801  100R, 1%, 1/10W  R_MET_0603  [0603]
R802  100R, 1%, 1/10W  R_MET_0603  [0603]
R803  100R, 1%, 1/10W  R_MET_0603  [0603]
R804  100R, 1%, 1/10W  R_MET_0603  [0603]
R805  100R, 1%, 1/10W  R_MET_0603  [0603]
R806  100R, 1%, 1/10W  R_MET_0603  [0603]
R807  100R, 1%, 1/10W  R_MET_0603  [0603]
R808  100R, 1%, 1/10W  R_MET_0603  [0603]
R809  100R, 1%, 1/10W  R_MET_0603  [0603]
R810  100R, 1%, 1/10W  R_MET_0603  [0603]
R811  100R, 1%, 1/10W  R_MET_0603  [0603]
R812  100R, 1%, 1/10W  R_MET_0603  [0603]
R813  100R, 1%, 1/10W  R_MET_0603  [0603]
Z801  6.8V, 500mW  MMSZ4XXX_T1G-DUMMY  [D_SMD_SOD-123_R_ON_REV01]
Z802  6.8V, 500mW  MMSZ4XXX_T1G-DUMMY  [D_SMD_SOD-123_R_ON_REV01]
Z803  6.8V, 500mW  MMSZ4XXX_T1G-DUMMY  [D_SMD_SOD-123_R_ON_REV01]
Z804  6.8V, 500mW  MMSZ4XXX_T1G-DUMMY  [D_SMD_SOD-123_R_ON_REV01]
Z805  6.8V, 500mW  MMSZ4XXX_T1G-DUMMY  [D_SMD_SOD-123_R_ON_REV01]
Z806  6.8V, 500mW  MMSZ4XXX_T1G-DUMMY  [D_SMD_SOD-123_R_ON_REV01]
Z807  6.8V, 500mW  MMSZ4XXX_T1G-DUMMY  [D_SMD_SOD-123_R_ON_REV01]
Z808  6.8V, 500mW  MMSZ4XXX_T1G-DUMMY  [D_SMD_SOD-123_R_ON_REV01]
Z809  6.8V, 500mW  MMSZ4XXX_T1G-DUMMY  [D_SMD_SOD-123_R_ON_REV01]
Z810  6.8V, 500mW  MMSZ4XXX_T1G-DUMMY  [D_SMD_SOD-123_R_ON_REV01]
Z811  6.8V, 500mW  MMSZ4XXX_T1G-DUMMY  [D_SMD_SOD-123_R_ON_REV01]
Z812  6.8V, 500mW  MMSZ4XXX_T1G-DUMMY  [D_SMD_SOD-123_R_ON_REV01]
Z813  6.8V, 500mW  MMSZ4XXX_T1G-DUMMY  [D_SMD_SOD-123_R_ON_REV01]

### Nets
FUSED_CELL_0+: R806.1 ; also sheet 9,12,14,15
FUSED_CELL_0-: R807.1 ; also sheet 9,15
FUSED_CELL_1+: R805.1 ; also sheet 9,12,14,15
FUSED_CELL_2+: R804.1 ; also sheet 9,12,14,15
FUSED_CELL_3+: R803.1 ; also sheet 9,12,14,15
FUSED_CELL_4+: R802.1 ; also sheet 9,12,14,15
FUSED_CELL_5+: R801.1 ; also sheet 9,12,14,15
FUSED_CELL_6+: R813.1 ; also sheet 9,12,14,15
FUSED_CELL_7+: R812.1 ; also sheet 9,12,14,15
FUSED_CELL_8+: R811.1 ; also sheet 9,12,14,15
FUSED_CELL_9+: R810.1 ; also sheet 9,12,14,15
FUSED_CELL_10+: R809.1 ; also sheet 9,12,14,15
FUSED_CELL_11+: R808.1 ; also sheet 9,12,15
FUSED_VBAT-: C801.2 C802.2 C803.2 C804.2 C805.2 C806.2 C807.2 C814.1 C815.2 C816.2 C817.2 C818.2 C819.2 C820.2 Z807.A ; also sheet 2,3,4,5,6,7,9,10,11,12,13,14,15,16,17,18
PRIMARY-C0: C807.1 C813.1 C814.2 R807.2 Z806.A Z807.K(C) ; also sheet 2
PRIMARY-C1: C806.1 C812.1 C813.2 R806.2 Z805.A Z806.K(C) ; also sheet 2
PRIMARY-C2: C805.1 C811.1 C812.2 R805.2 Z804.A Z805.K(C) ; also sheet 2
PRIMARY-C3: C804.1 C810.1 C811.2 R804.2 Z803.A Z804.K(C) ; also sheet 2
PRIMARY-C4: C803.1 C809.1 C810.2 R803.2 Z802.A Z803.K(C) ; also sheet 2
PRIMARY-C5: C802.1 C808.1 C809.2 R802.2 Z801.A Z802.K(C) ; also sheet 2
PRIMARY-C6: C801.1 C808.2 C826.1 R801.2 Z801.K(C) Z813.A ; also sheet 2
PRIMARY-C7: C820.1 C825.1 C826.2 R813.2 Z812.A Z813.K(C) ; also sheet 2
PRIMARY-C8: C819.1 C824.1 C825.2 R812.2 Z811.A Z812.K(C) ; also sheet 2
PRIMARY-C9: C818.1 C823.1 C824.2 R811.2 Z810.A Z811.K(C) ; also sheet 2
PRIMARY-C10: C817.1 C822.1 C823.2 R810.2 Z809.A Z810.K(C) ; also sheet 2
PRIMARY-C11: C816.1 C821.1 C822.2 R809.2 Z808.A Z809.K(C) ; also sheet 2
PRIMARY-C12: C815.1 C821.2 R808.2 Z808.K(C) ; also sheet 2

### Notes on the sheet
- optional | optional
- Status: A
- Primary Voltage Measurement
- low-pass filter
  C = 100nF -> fg = 16kHz
  C = 22nF -> fg = 72kHz
  C = 10nF -> fg = 160kHz (datasheet value)

## Sheet 9 of 18: Secondary Voltage Measurement
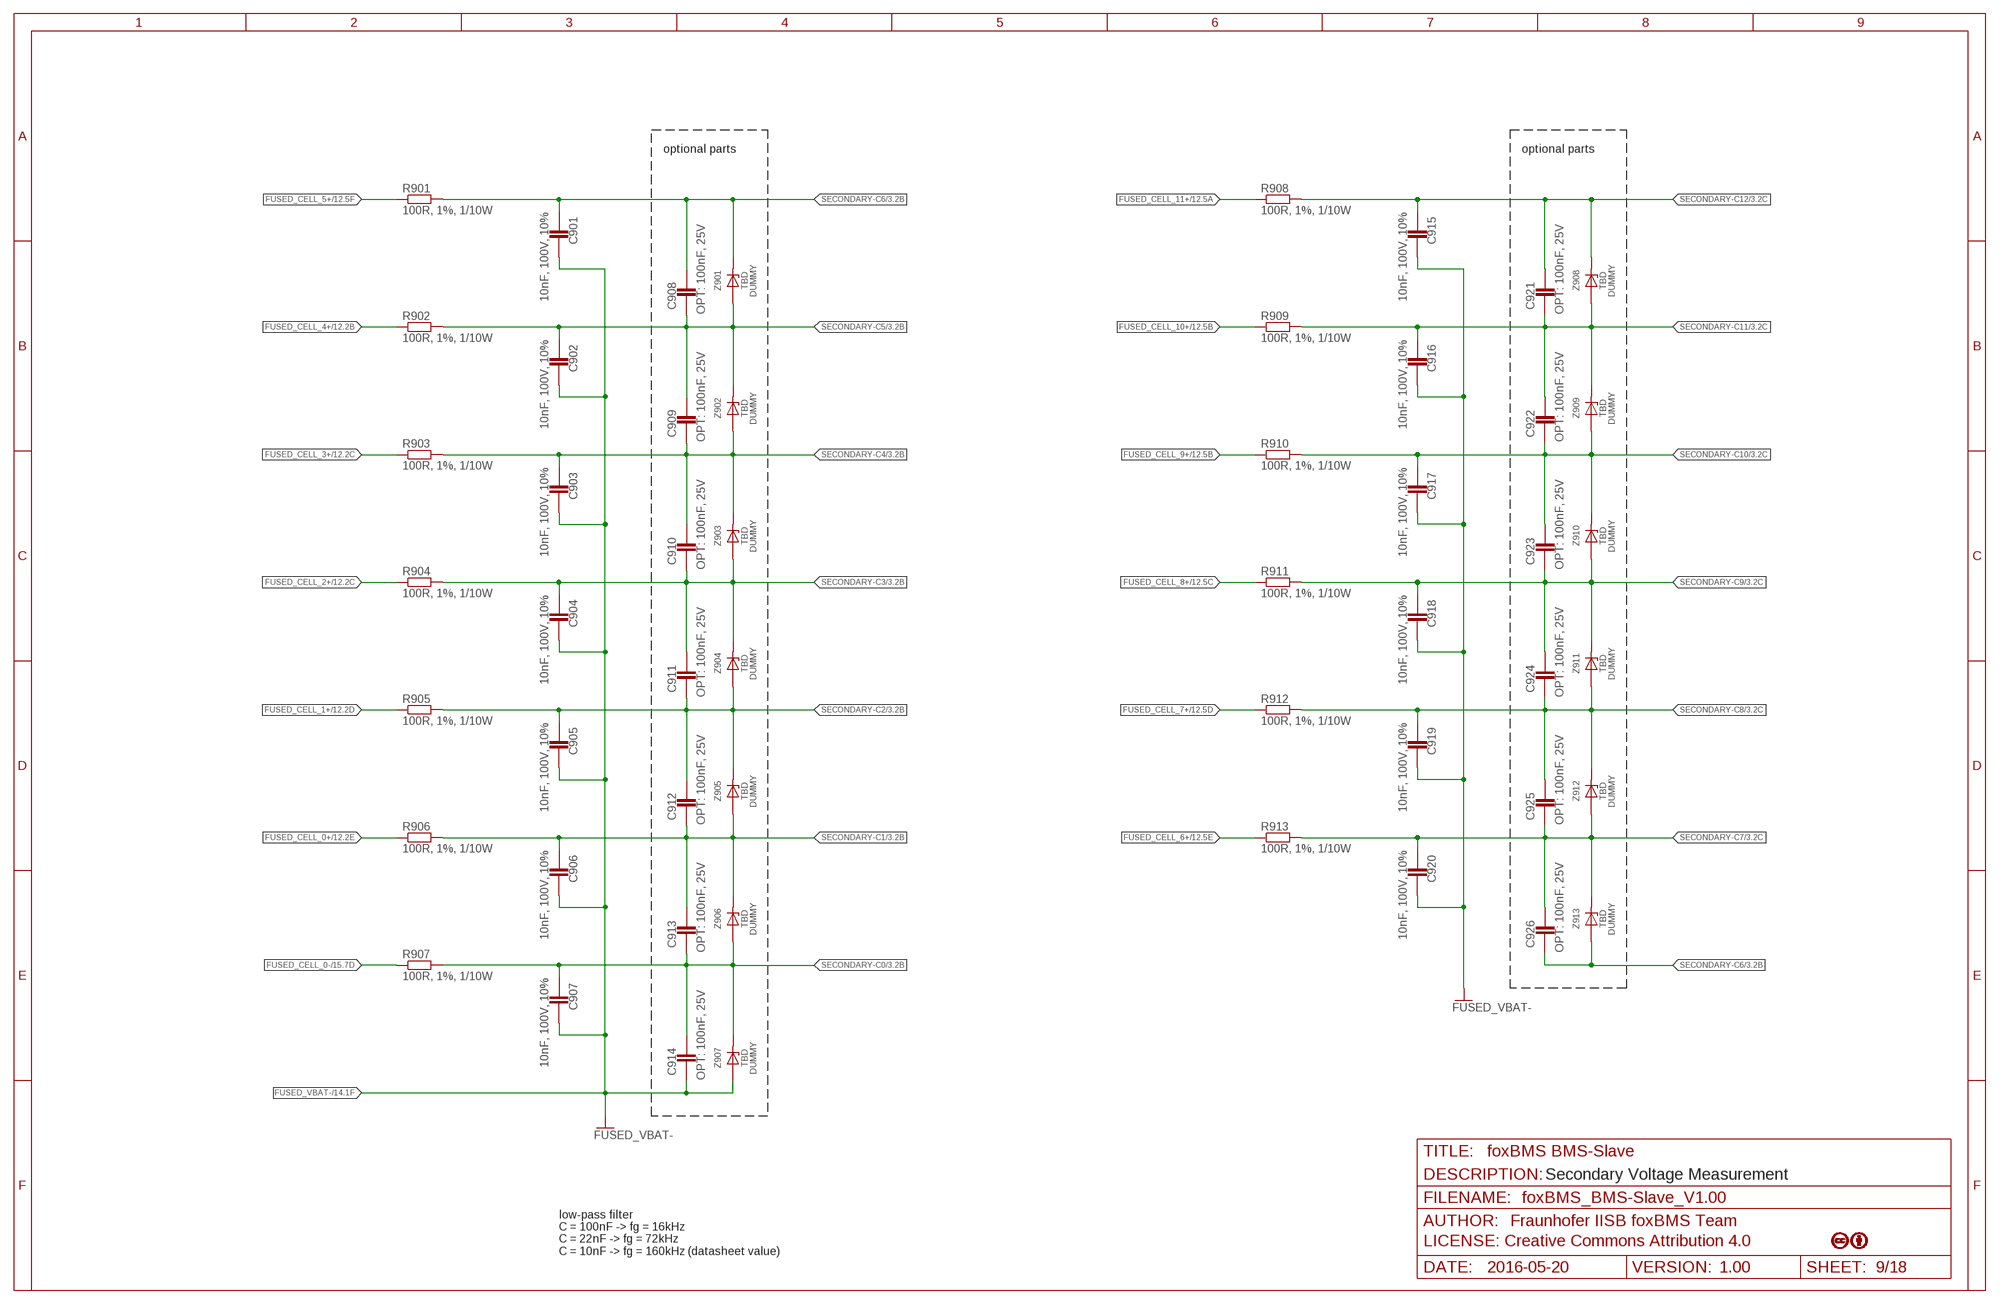
[diagram p9: schematic, sheet 9]

### Parts
C901  10nF, 100V, 10%  C_NP0_0603  [0603]
C902  10nF, 100V, 10%  C_NP0_0603  [0603]
C903  10nF, 100V, 10%  C_NP0_0603  [0603]
C904  10nF, 100V, 10%  C_NP0_0603  [0603]
C905  10nF, 100V, 10%  C_NP0_0603  [0603]
C906  10nF, 100V, 10%  C_NP0_0603  [0603]
C907  10nF, 100V, 10%  C_NP0_0603  [0603]
C908  OPT: 100nF, 25V  C_NP0_0805  [0805]
C909  OPT: 100nF, 25V  C_NP0_0805  [0805]
C910  OPT: 100nF, 25V  C_NP0_0805  [0805]
C911  OPT: 100nF, 25V  C_NP0_0805  [0805]
C912  OPT: 100nF, 25V  C_NP0_0805  [0805]
C913  OPT: 100nF, 25V  C_NP0_0805  [0805]
C914  OPT: 100nF, 25V  C_NP0_0805  [0805]
C915  10nF, 100V, 10%  C_NP0_0603  [0603]
C916  10nF, 100V, 10%  C_NP0_0603  [0603]
C917  10nF, 100V, 10%  C_NP0_0603  [0603]
C918  10nF, 100V, 10%  C_NP0_0603  [0603]
C919  10nF, 100V, 10%  C_NP0_0603  [0603]
C920  10nF, 100V, 10%  C_NP0_0603  [0603]
C921  OPT: 100nF, 25V  C_NP0_0805  [0805]
C922  OPT: 100nF, 25V  C_NP0_0805  [0805]
C923  OPT: 100nF, 25V  C_NP0_0805  [0805]
C924  OPT: 100nF, 25V  C_NP0_0805  [0805]
C925  OPT: 100nF, 25V  C_NP0_0805  [0805]
C926  OPT: 100nF, 25V  C_NP0_0805  [0805]
R901  100R, 1%, 1/10W  R_MET_0603  [0603]
R902  100R, 1%, 1/10W  R_MET_0603  [0603]
R903  100R, 1%, 1/10W  R_MET_0603  [0603]
R904  100R, 1%, 1/10W  R_MET_0603  [0603]
R905  100R, 1%, 1/10W  R_MET_0603  [0603]
R906  100R, 1%, 1/10W  R_MET_0603  [0603]
R907  100R, 1%, 1/10W  R_MET_0603  [0603]
R908  100R, 1%, 1/10W  R_MET_0603  [0603]
R909  100R, 1%, 1/10W  R_MET_0603  [0603]
R910  100R, 1%, 1/10W  R_MET_0603  [0603]
R911  100R, 1%, 1/10W  R_MET_0603  [0603]
R912  100R, 1%, 1/10W  R_MET_0603  [0603]
R913  100R, 1%, 1/10W  R_MET_0603  [0603]
Z901  6.8V, 500mW  MMSZ4XXX_T1G-DUMMY  [D_SMD_SOD-123_R_ON_REV01]
Z902  6.8V, 500mW  MMSZ4XXX_T1G-DUMMY  [D_SMD_SOD-123_R_ON_REV01]
Z903  6.8V, 500mW  MMSZ4XXX_T1G-DUMMY  [D_SMD_SOD-123_R_ON_REV01]
Z904  6.8V, 500mW  MMSZ4XXX_T1G-DUMMY  [D_SMD_SOD-123_R_ON_REV01]
Z905  6.8V, 500mW  MMSZ4XXX_T1G-DUMMY  [D_SMD_SOD-123_R_ON_REV01]
Z906  6.8V, 500mW  MMSZ4XXX_T1G-DUMMY  [D_SMD_SOD-123_R_ON_REV01]
Z907  6.8V, 500mW  MMSZ4XXX_T1G-DUMMY  [D_SMD_SOD-123_R_ON_REV01]
Z908  6.8V, 500mW  MMSZ4XXX_T1G-DUMMY  [D_SMD_SOD-123_R_ON_REV01]
Z909  6.8V, 500mW  MMSZ4XXX_T1G-DUMMY  [D_SMD_SOD-123_R_ON_REV01]
Z910  6.8V, 500mW  MMSZ4XXX_T1G-DUMMY  [D_SMD_SOD-123_R_ON_REV01]
Z911  6.8V, 500mW  MMSZ4XXX_T1G-DUMMY  [D_SMD_SOD-123_R_ON_REV01]
Z912  6.8V, 500mW  MMSZ4XXX_T1G-DUMMY  [D_SMD_SOD-123_R_ON_REV01]
Z913  6.8V, 500mW  MMSZ4XXX_T1G-DUMMY  [D_SMD_SOD-123_R_ON_REV01]

### Nets
FUSED_CELL_0+: R906.1 ; also sheet 8,12,14,15
FUSED_CELL_0-: R907.1 ; also sheet 8,15
FUSED_CELL_1+: R905.1 ; also sheet 8,12,14,15
FUSED_CELL_2+: R904.1 ; also sheet 8,12,14,15
FUSED_CELL_3+: R903.1 ; also sheet 8,12,14,15
FUSED_CELL_4+: R902.1 ; also sheet 8,12,14,15
FUSED_CELL_5+: R901.1 ; also sheet 8,12,14,15
FUSED_CELL_6+: R913.1 ; also sheet 8,12,14,15
FUSED_CELL_7+: R912.1 ; also sheet 8,12,14,15
FUSED_CELL_8+: R911.1 ; also sheet 8,12,14,15
FUSED_CELL_9+: R910.1 ; also sheet 8,12,14,15
FUSED_CELL_10+: R909.1 ; also sheet 8,12,14,15
FUSED_CELL_11+: R908.1 ; also sheet 8,12,15
FUSED_VBAT-: C901.2 C902.2 C903.2 C904.2 C905.2 C906.2 C907.2 C914.1 C915.2 C916.2 C917.2 C918.2 C919.2 C920.2 Z907.A ; also sheet 2,3,4,5,6,7,8,10,11,12,13,14,15,16,17,18
SECONDARY-C0: C907.1 C913.1 C914.2 R907.2 Z906.A Z907.K(C) ; also sheet 3
SECONDARY-C1: C906.1 C912.1 C913.2 R906.2 Z905.A Z906.K(C) ; also sheet 3
SECONDARY-C2: C905.1 C911.1 C912.2 R905.2 Z904.A Z905.K(C) ; also sheet 3
SECONDARY-C3: C904.1 C910.1 C911.2 R904.2 Z903.A Z904.K(C) ; also sheet 3
SECONDARY-C4: C903.1 C909.1 C910.2 R903.2 Z902.A Z903.K(C) ; also sheet 3
SECONDARY-C5: C902.1 C908.1 C909.2 R902.2 Z901.A Z902.K(C) ; also sheet 3
SECONDARY-C6: C901.1 C908.2 C926.1 R901.2 Z901.K(C) Z913.A ; also sheet 3
SECONDARY-C7: C920.1 C925.1 C926.2 R913.2 Z912.A Z913.K(C) ; also sheet 3
SECONDARY-C8: C919.1 C924.1 C925.2 R912.2 Z911.A Z912.K(C) ; also sheet 3
SECONDARY-C9: C918.1 C923.1 C924.2 R911.2 Z910.A Z911.K(C) ; also sheet 3
SECONDARY-C10: C917.1 C922.1 C923.2 R910.2 Z909.A Z910.K(C) ; also sheet 3
SECONDARY-C11: C916.1 C921.1 C922.2 R909.2 Z908.A Z909.K(C) ; also sheet 3
SECONDARY-C12: C915.1 C921.2 R908.2 Z908.K(C) ; also sheet 3

### Notes on the sheet
- optional parts | optional parts
- Status: A
- Secondary Voltage Measurement
- low-pass filter
  C = 100nF -> fg = 16kHz
  C = 22nF -> fg = 72kHz
  C = 10nF -> fg = 160kHz (datasheet value)

## Sheet 10 of 18: Primary Temperature Measurement
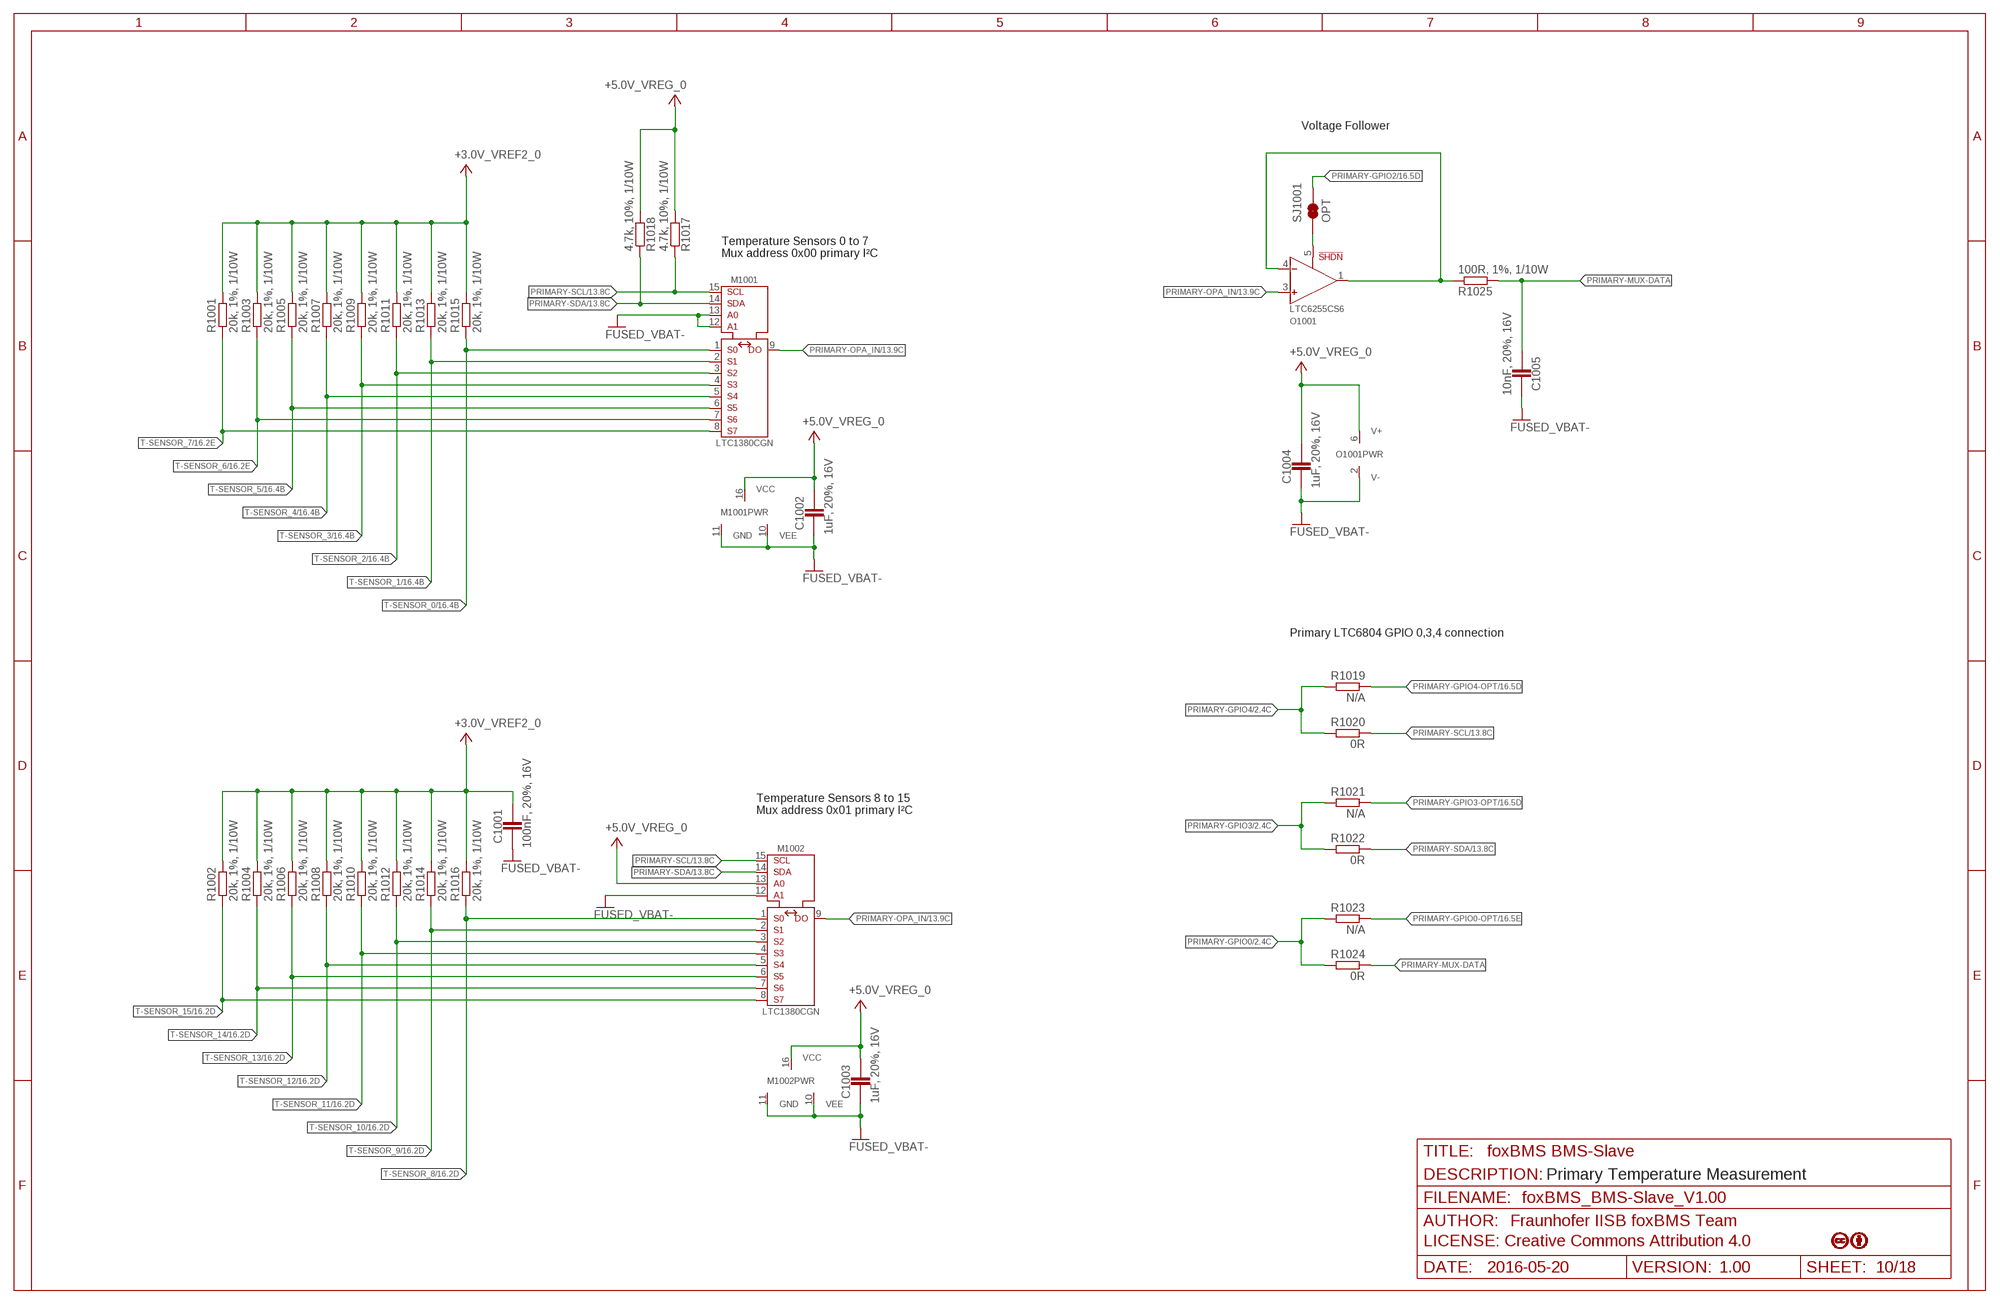
[diagram p10: schematic, sheet 10]

### Parts
C1001  100nF, 20%, 16V  C_NP0_0603  [0603]
C1002  1uF, 20%, 16V  C_NP0_0603  [0603]
C1003  1uF, 20%, 16V  C_NP0_0603  [0603]
C1004  1uF, 20%, 16V  C_NP0_0603  [0603]
C1005  10nF, 20%, 16V  C_NP0_0603  [0603]
M1001  LTC1380CGN  [IC_SMD_SSOP-16_(GN16)_R_LINEAR_REV01]
M1002  LTC1380CGN  [IC_SMD_SSOP-16_(GN16)_R_LINEAR_REV01]
O1001  LTC6255CS6  [IC_SMD_TSOT-23-6_(S6)_R_LINEAR_REV01]
R1001  20k, 1%, 1/10W  R_MET_0603  [0603]
R1002  20k, 1%, 1/10W  R_MET_0603  [0603]
R1003  20k, 1%, 1/10W  R_MET_0603  [0603]
R1004  20k, 1%, 1/10W  R_MET_0603  [0603]
R1005  20k, 1%, 1/10W  R_MET_0603  [0603]
R1006  20k, 1%, 1/10W  R_MET_0603  [0603]
R1007  20k, 1%, 1/10W  R_MET_0603  [0603]
R1008  20k, 1%, 1/10W  R_MET_0603  [0603]
R1009  20k, 1%, 1/10W  R_MET_0603  [0603]
R1010  20k, 1%, 1/10W  R_MET_0603  [0603]
R1011  20k, 1%, 1/10W  R_MET_0603  [0603]
R1012  20k, 1%, 1/10W  R_MET_0603  [0603]
R1013  20k, 1%, 1/10W  R_MET_0603  [0603]
R1014  20k, 1%, 1/10W  R_MET_0603  [0603]
R1015  20k, 1%, 1/10W  R_MET_0603  [0603]
R1016  20k, 1%, 1/10W  R_MET_0603  [0603]
R1017  4.7k, 10%, 1/10W  R_MET_0603  [0603]
R1018  4.7k, 10%, 1/10W  R_MET_0603  [0603]
R1019  N/A  R_MET_0603  [0603]
R1020  0R  R_MET_0603  [0603]
R1021  N/A  R_MET_0603  [0603]
R1022  0R  R_MET_0603  [0603]
R1023  N/A  R_MET_0603  [0603]
R1024  0R  R_MET_0603  [0603]
R1025  100R, 1%, 1/10W  R_MET_0603  [0603]
SJ1001  OPT  SJ  [SJ]

### Nets
+3.0V_VREF2_0: C1001.2 R1001.2 R1002.2 R1003.2 R1004.2 R1005.2 R1006.2 R1007.2 R1008.2 R1009.2 R1010.2 R1011.2 R1012.2 R1013.2 R1014.2 R1015.2 R1016.2 ; also sheet 2,4,16
+5.0V_VREG_0: C1002.2 C1003.2 C1004.2 M1001.16(VCC) M1002.13(A0) M1002.16(VCC) O1001.6(V+) R1017.2 R1018.2 ; also sheet 2,4,6,13,16,17
FUSED_VBAT-: C1001.1 C1002.1 C1003.1 C1004.1 C1005.1 M1001.10(VEE) M1001.11(GND) M1001.12(A1) M1001.13(A0) M1002.10(VEE) M1002.11(GND) M1002.12(A1) O1001.2(V-) ; also sheet 2,3,4,5,6,7,8,9,11,12,13,14,15,16,17,18
N$6: O1001.1(VOUT) O1001.4(-) R1025.1
N$16: O1001.5(!SHDN) SJ1001.1
PRIMARY-GPIO0: R1023.2 R1024.2 ; also sheet 2
PRIMARY-GPIO0-OPT: R1023.1 ; also sheet 16
PRIMARY-GPIO2: SJ1001.2 ; also sheet 2,16
PRIMARY-GPIO3: R1021.2 R1022.2 ; also sheet 2
PRIMARY-GPIO3-OPT: R1021.1 ; also sheet 16
PRIMARY-GPIO4: R1019.2 R1020.2 ; also sheet 2
PRIMARY-GPIO4-OPT: R1019.1 ; also sheet 16
PRIMARY-MUX-DATA: C1005.2 R1024.1 R1025.2
PRIMARY-OPA_IN: M1001.9(DO) M1002.9(DO) O1001.3(+) ; also sheet 13
PRIMARY-SCL: M1001.15(SCL) M1002.15(SCL) R1017.1 R1020.1 ; also sheet 13,17
PRIMARY-SDA: M1001.14(SDA) M1002.14(SDA) R1018.1 R1022.1 ; also sheet 13,17
T-SENSOR_0: M1001.1(S0) R1015.1 ; also sheet 16
T-SENSOR_1: M1001.2(S1) R1013.1 ; also sheet 16
T-SENSOR_2: M1001.3(S2) R1011.1 ; also sheet 16
T-SENSOR_3: M1001.4(S3) R1009.1 ; also sheet 16
T-SENSOR_4: M1001.5(S4) R1007.1 ; also sheet 16
T-SENSOR_5: M1001.6(S5) R1005.1 ; also sheet 16
T-SENSOR_6: M1001.7(S6) R1003.1 ; also sheet 16
T-SENSOR_7: M1001.8(S7) R1001.1 ; also sheet 16
T-SENSOR_8: M1002.1(S0) R1016.1 ; also sheet 16
T-SENSOR_9: M1002.2(S1) R1014.1 ; also sheet 16
T-SENSOR_10: M1002.3(S2) R1012.1 ; also sheet 16
T-SENSOR_11: M1002.4(S3) R1010.1 ; also sheet 16
T-SENSOR_12: M1002.5(S4) R1008.1 ; also sheet 16
T-SENSOR_13: M1002.6(S5) R1006.1 ; also sheet 16
T-SENSOR_14: M1002.7(S6) R1004.1 ; also sheet 16
T-SENSOR_15: M1002.8(S7) R1002.1 ; also sheet 16

### Notes on the sheet
- Voltage Follower
- Temperature Sensors 0 to 7
  Mux address 0x00 primary I²C
- Primary LTC6804 GPIO 0,3,4 connection
- Temperature Sensors 8 to 15
  Mux address 0x01 primary I²C
- Status: A
- Primary Temperature Measurement

## Sheet 11 of 18: Secondary Temperature Measurement
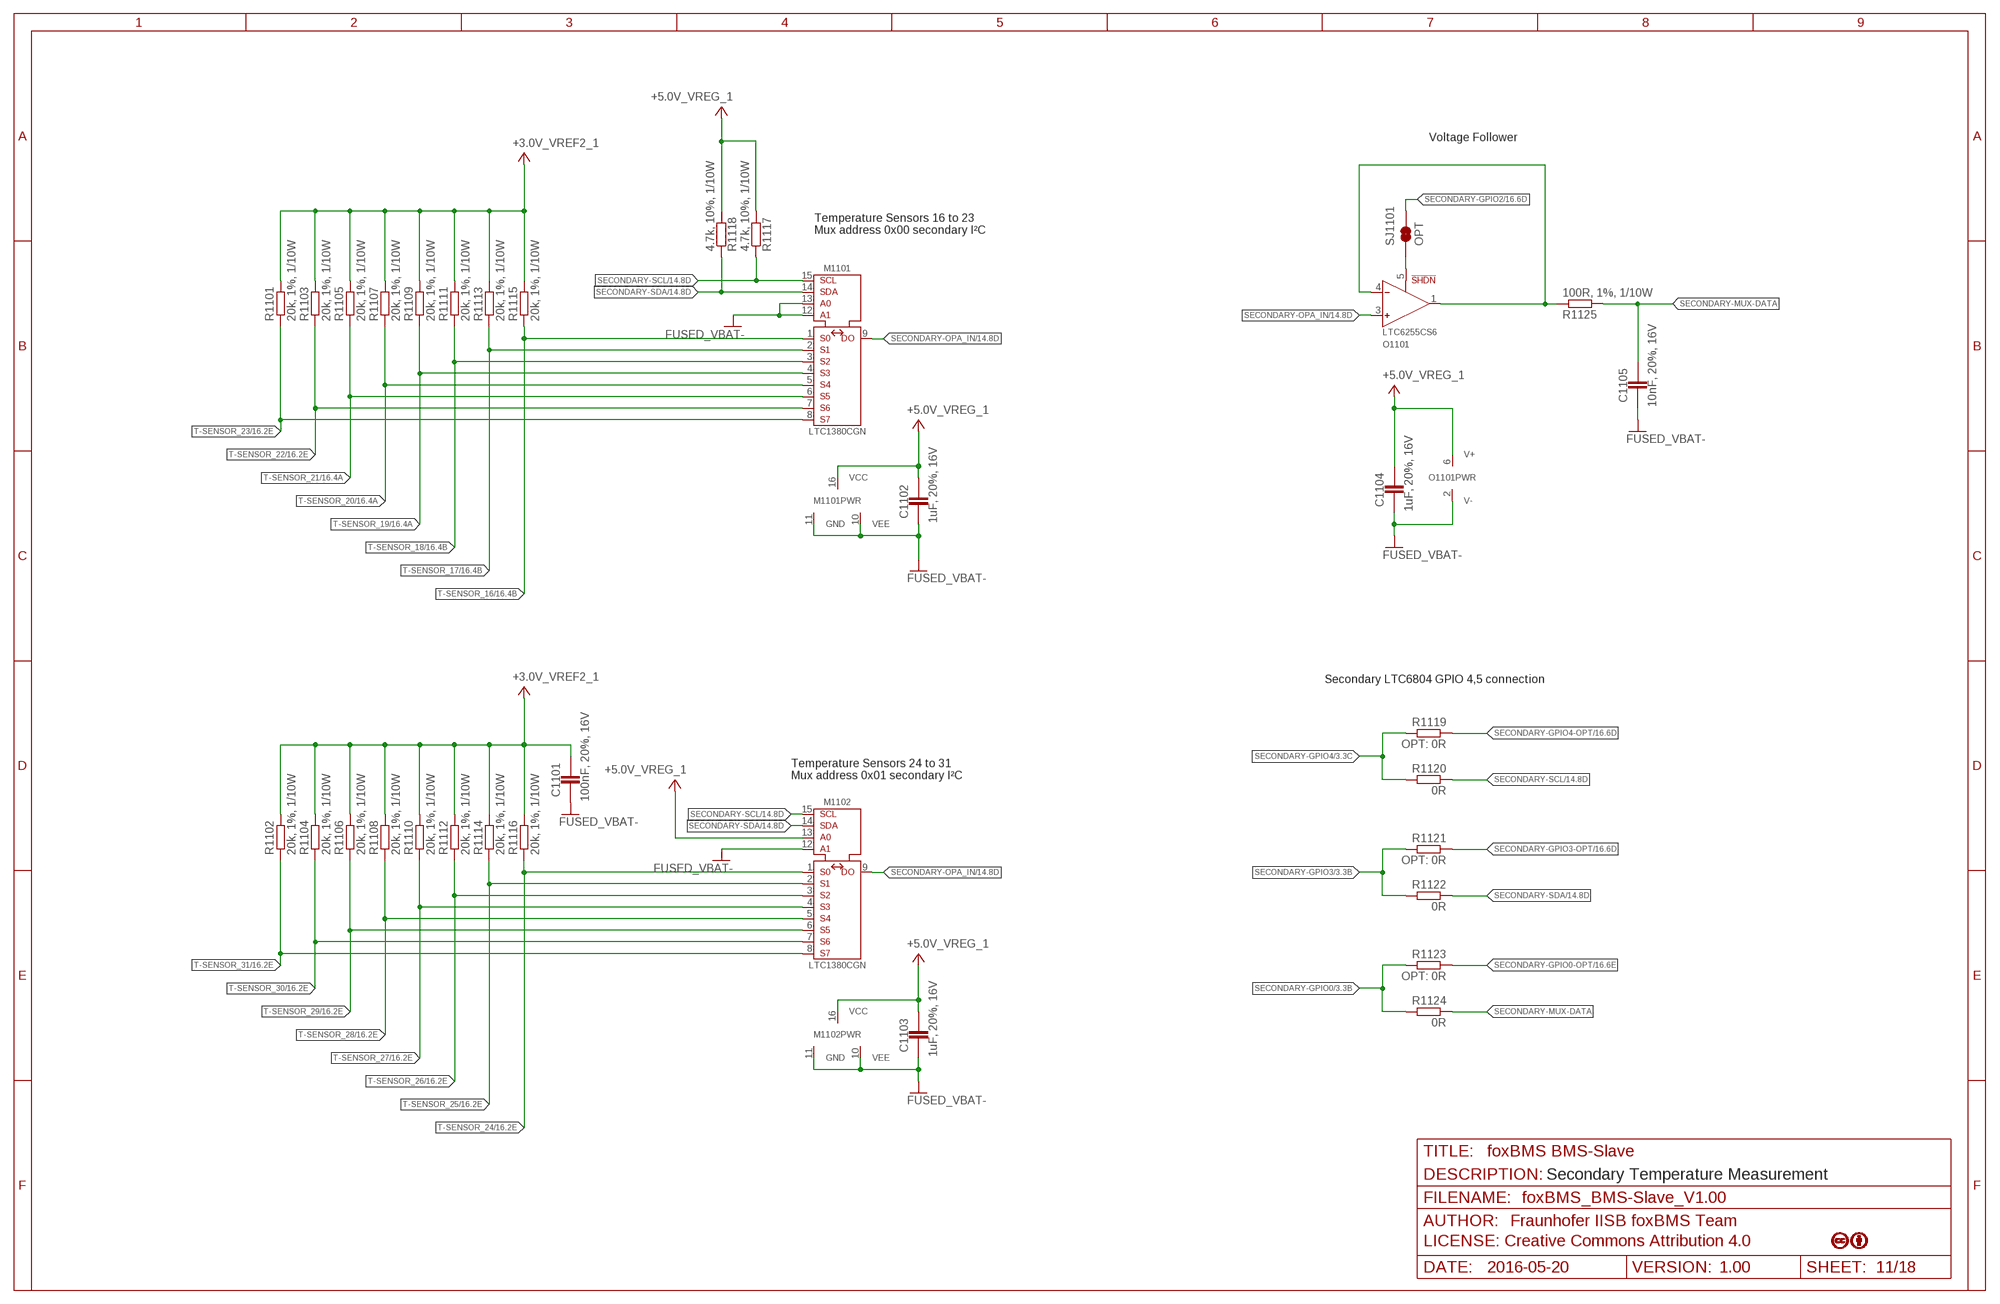
[diagram p11: schematic, sheet 11]

### Parts
C1101  100nF, 20%, 16V  C_NP0_0603  [0603]
C1102  1uF, 20%, 16V  C_NP0_0603  [0603]
C1103  1uF, 20%, 16V  C_NP0_0603  [0603]
C1104  1uF, 20%, 16V  C_NP0_0603  [0603]
C1105  10nF, 20%, 16V  C_NP0_0603  [0603]
M1101  LTC1380CGN  [IC_SMD_SSOP-16_(GN16)_R_LINEAR_REV01]
M1102  LTC1380CGN  [IC_SMD_SSOP-16_(GN16)_R_LINEAR_REV01]
O1101  LTC6255CS6  [IC_SMD_TSOT-23-6_(S6)_R_LINEAR_REV01]
R1101  20k, 1%, 1/10W  R_MET_0603  [0603]
R1102  20k, 1%, 1/10W  R_MET_0603  [0603]
R1103  20k, 1%, 1/10W  R_MET_0603  [0603]
R1104  20k, 1%, 1/10W  R_MET_0603  [0603]
R1105  20k, 1%, 1/10W  R_MET_0603  [0603]
R1106  20k, 1%, 1/10W  R_MET_0603  [0603]
R1107  20k, 1%, 1/10W  R_MET_0603  [0603]
R1108  20k, 1%, 1/10W  R_MET_0603  [0603]
R1109  20k, 1%, 1/10W  R_MET_0603  [0603]
R1110  20k, 1%, 1/10W  R_MET_0603  [0603]
R1111  20k, 1%, 1/10W  R_MET_0603  [0603]
R1112  20k, 1%, 1/10W  R_MET_0603  [0603]
R1113  20k, 1%, 1/10W  R_MET_0603  [0603]
R1114  20k, 1%, 1/10W  R_MET_0603  [0603]
R1115  20k, 1%, 1/10W  R_MET_0603  [0603]
R1116  20k, 1%, 1/10W  R_MET_0603  [0603]
R1117  4.7k, 10%, 1/10W  R_MET_0603  [0603]
R1118  4.7k, 10%, 1/10W  R_MET_0603  [0603]
R1119  OPT: 0R  R_MET_0603  [0603]
R1120  0R  R_MET_0603  [0603]
R1121  OPT: 0R  R_MET_0603  [0603]
R1122  0R  R_MET_0603  [0603]
R1123  OPT: 0R  R_MET_0603  [0603]
R1124  0R  R_MET_0603  [0603]
R1125  100R, 1%, 1/10W  R_MET_0603  [0603]
SJ1101  OPT  SJ  [SJ]

### Nets
+3.0V_VREF2_1: C1101.2 R1101.2 R1102.2 R1103.2 R1104.2 R1105.2 R1106.2 R1107.2 R1108.2 R1109.2 R1110.2 R1111.2 R1112.2 R1113.2 R1114.2 R1115.2 R1116.2 ; also sheet 3,5,16
+5.0V_VREG_1: C1102.2 C1103.2 C1104.2 M1101.16(VCC) M1102.13(A0) M1102.16(VCC) O1101.6(V+) R1117.2 R1118.2 ; also sheet 3,5,7,14,16,18
FUSED_VBAT-: C1101.1 C1102.1 C1103.1 C1104.1 C1105.1 M1101.10(VEE) M1101.11(GND) M1101.12(A1) M1101.13(A0) M1102.10(VEE) M1102.11(GND) M1102.12(A1) O1101.2(V-) ; also sheet 2,3,4,5,6,7,8,9,10,12,13,14,15,16,17,18
N$14: O1101.5(!SHDN) SJ1101.1
N$34: O1101.1(VOUT) O1101.4(-) R1125.1
SECONDARY-GPIO0: R1123.2 R1124.2 ; also sheet 3
SECONDARY-GPIO0-OPT: R1123.1 ; also sheet 16
SECONDARY-GPIO2: SJ1101.2 ; also sheet 3,16
SECONDARY-GPIO3: R1121.2 R1122.2 ; also sheet 3
SECONDARY-GPIO3-OPT: R1121.1 ; also sheet 16
SECONDARY-GPIO4: R1119.2 R1120.2 ; also sheet 3
SECONDARY-GPIO4-OPT: R1119.1 ; also sheet 16
SECONDARY-MUX-DATA: C1105.2 R1124.1 R1125.2
SECONDARY-OPA_IN: M1101.9(DO) M1102.9(DO) O1101.3(+) ; also sheet 14
SECONDARY-SCL: M1101.15(SCL) M1102.15(SCL) R1117.1 R1120.1 ; also sheet 14,18
SECONDARY-SDA: M1101.14(SDA) M1102.14(SDA) R1118.1 R1122.1 ; also sheet 14,18
T-SENSOR_16: M1101.1(S0) R1115.1 ; also sheet 16
T-SENSOR_17: M1101.2(S1) R1113.1 ; also sheet 16
T-SENSOR_18: M1101.3(S2) R1111.1 ; also sheet 16
T-SENSOR_19: M1101.4(S3) R1109.1 ; also sheet 16
T-SENSOR_20: M1101.5(S4) R1107.1 ; also sheet 16
T-SENSOR_21: M1101.6(S5) R1105.1 ; also sheet 16
T-SENSOR_22: M1101.7(S6) R1103.1 ; also sheet 16
T-SENSOR_23: M1101.8(S7) R1101.1 ; also sheet 16
T-SENSOR_24: M1102.1(S0) R1116.1 ; also sheet 16
T-SENSOR_25: M1102.2(S1) R1114.1 ; also sheet 16
T-SENSOR_26: M1102.3(S2) R1112.1 ; also sheet 16
T-SENSOR_27: M1102.4(S3) R1110.1 ; also sheet 16
T-SENSOR_28: M1102.5(S4) R1108.1 ; also sheet 16
T-SENSOR_29: M1102.6(S5) R1106.1 ; also sheet 16
T-SENSOR_30: M1102.7(S6) R1104.1 ; also sheet 16
T-SENSOR_31: M1102.8(S7) R1102.1 ; also sheet 16

### Notes on the sheet
- Voltage Follower
- Temperature Sensors 16 to 23
  Mux address 0x00 secondary I²C
- Secondary LTC6804 GPIO 4,5 connection
- Temperature Sensors 24 to 31
  Mux address 0x01 secondary I²C
- Status: A
- Secondary Temperature Measurement

## Sheet 12 of 18: Passive Cell Balancing
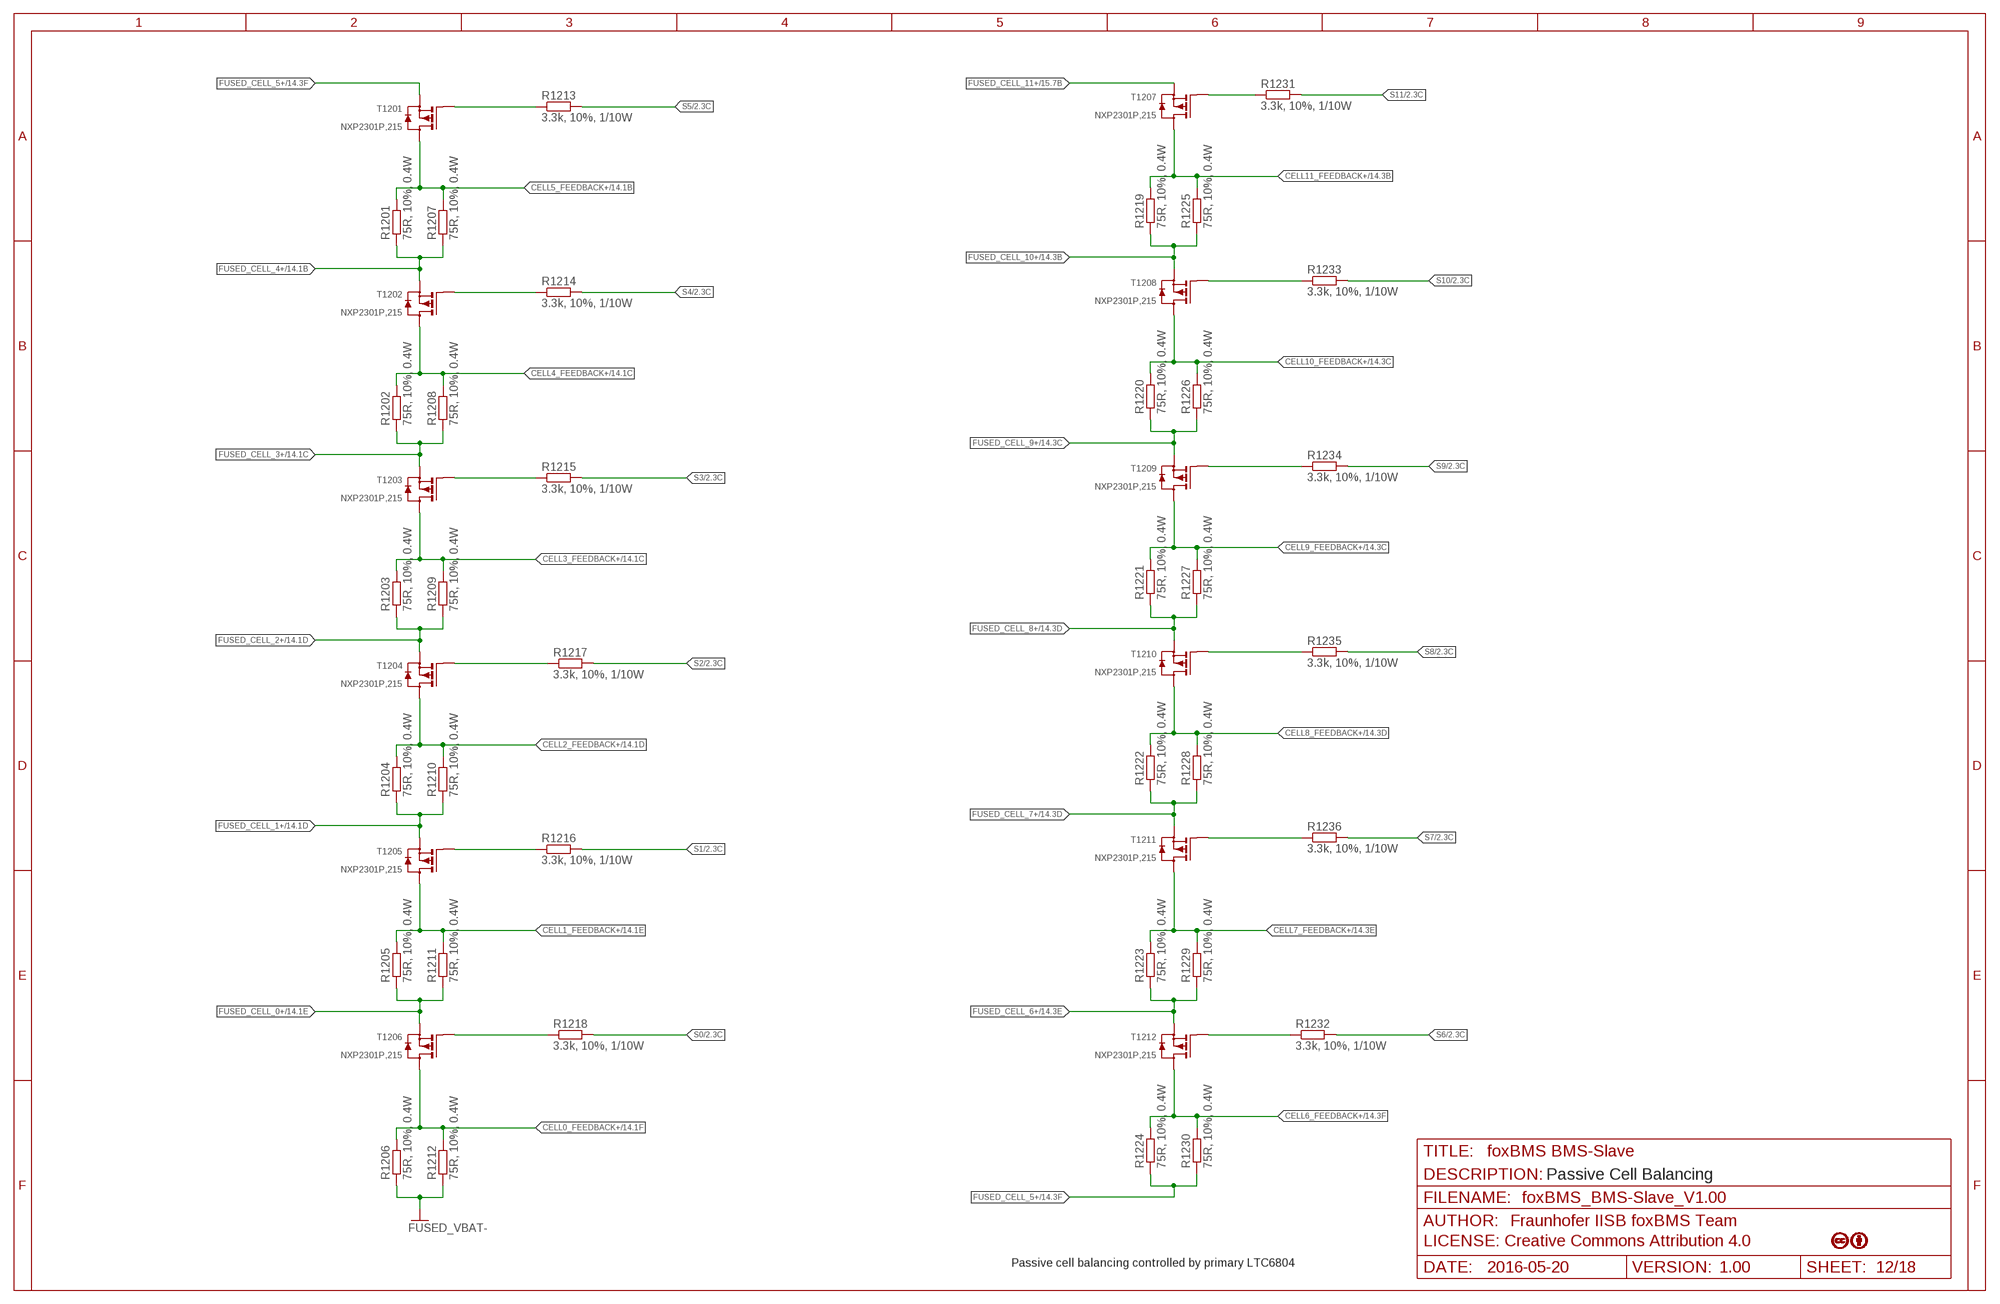
[diagram p12: schematic, sheet 12]

### Parts
R1201  75R, 10%, 0.4W  R2010  [2010]
R1202  75R, 10%, 0.4W  R2010  [2010]
R1203  75R, 10%, 0.4W  R2010  [2010]
R1204  75R, 10%, 0.4W  R2010  [2010]
R1205  75R, 10%, 0.4W  R2010  [2010]
R1206  75R, 10%, 0.4W  R2010  [2010]
R1207  75R, 10%, 0.4W  R2010  [2010]
R1208  75R, 10%, 0.4W  R2010  [2010]
R1209  75R, 10%, 0.4W  R2010  [2010]
R1210  75R, 10%, 0.4W  R2010  [2010]
R1211  75R, 10%, 0.4W  R2010  [2010]
R1212  75R, 10%, 0.4W  R2010  [2010]
R1213  3.3k, 10%, 1/10W  R_MET_0603  [0603]
R1214  3.3k, 10%, 1/10W  R_MET_0603  [0603]
R1215  3.3k, 10%, 1/10W  R_MET_0603  [0603]
R1216  3.3k, 10%, 1/10W  R_MET_0603  [0603]
R1217  3.3k, 10%, 1/10W  R_MET_0603  [0603]
R1218  3.3k, 10%, 1/10W  R_MET_0603  [0603]
R1219  75R, 10%, 0.4W  R2010  [2010]
R1220  75R, 10%, 0.4W  R2010  [2010]
R1221  75R, 10%, 0.4W  R2010  [2010]
R1222  75R, 10%, 0.4W  R2010  [2010]
R1223  75R, 10%, 0.4W  R2010  [2010]
R1224  75R, 10%, 0.4W  R2010  [2010]
R1225  75R, 10%, 0.4W  R2010  [2010]
R1226  75R, 10%, 0.4W  R2010  [2010]
R1227  75R, 10%, 0.4W  R2010  [2010]
R1228  75R, 10%, 0.4W  R2010  [2010]
R1229  75R, 10%, 0.4W  R2010  [2010]
R1230  75R, 10%, 0.4W  R2010  [2010]
R1231  3.3k, 10%, 1/10W  R_MET_0603  [0603]
R1232  3.3k, 10%, 1/10W  R_MET_0603  [0603]
R1233  3.3k, 10%, 1/10W  R_MET_0603  [0603]
R1234  3.3k, 10%, 1/10W  R_MET_0603  [0603]
R1235  3.3k, 10%, 1/10W  R_MET_0603  [0603]
R1236  3.3k, 10%, 1/10W  R_MET_0603  [0603]
T1201  NX2301P  NX2301P,215  [D_SMD_SOT23_(TO-236AB)_R_NXP_REV01]
T1202  NX2301P  NX2301P,215  [D_SMD_SOT23_(TO-236AB)_R_NXP_REV01]
T1203  NX2301P  NX2301P,215  [D_SMD_SOT23_(TO-236AB)_R_NXP_REV01]
T1204  NX2301P  NX2301P,215  [D_SMD_SOT23_(TO-236AB)_R_NXP_REV01]
T1205  NX2301P  NX2301P,215  [D_SMD_SOT23_(TO-236AB)_R_NXP_REV01]
T1206  NX2301P  NX2301P,215  [D_SMD_SOT23_(TO-236AB)_R_NXP_REV01]
T1207  NX2301P  NX2301P,215  [D_SMD_SOT23_(TO-236AB)_R_NXP_REV01]
T1208  NX2301P  NX2301P,215  [D_SMD_SOT23_(TO-236AB)_R_NXP_REV01]
T1209  NX2301P  NX2301P,215  [D_SMD_SOT23_(TO-236AB)_R_NXP_REV01]
T1210  NX2301P  NX2301P,215  [D_SMD_SOT23_(TO-236AB)_R_NXP_REV01]
T1211  NX2301P  NX2301P,215  [D_SMD_SOT23_(TO-236AB)_R_NXP_REV01]
T1212  NX2301P  NX2301P,215  [D_SMD_SOT23_(TO-236AB)_R_NXP_REV01]

### Nets
CELL0_FEEDBACK+: R1206.2 R1212.2 T1206.3(D) ; also sheet 14
CELL1_FEEDBACK+: R1205.2 R1211.2 T1205.3(D) ; also sheet 14
CELL2_FEEDBACK+: R1204.2 R1210.2 T1204.3(D) ; also sheet 14
CELL3_FEEDBACK+: R1203.2 R1209.2 T1203.3(D) ; also sheet 14
CELL4_FEEDBACK+: R1202.2 R1208.2 T1202.3(D) ; also sheet 14
CELL5_FEEDBACK+: R1201.2 R1207.2 T1201.3(D) ; also sheet 14
CELL6_FEEDBACK+: R1224.2 R1230.2 T1212.3(D) ; also sheet 14
CELL7_FEEDBACK+: R1223.2 R1229.2 T1211.3(D) ; also sheet 14
CELL8_FEEDBACK+: R1222.2 R1228.2 T1210.3(D) ; also sheet 14
CELL9_FEEDBACK+: R1221.2 R1227.2 T1209.3(D) ; also sheet 14
CELL10_FEEDBACK+: R1220.2 R1226.2 T1208.3(D) ; also sheet 14
CELL11_FEEDBACK+: R1219.2 R1225.2 T1207.3(D) ; also sheet 14
FUSED_CELL_0+: R1205.1 R1211.1 T1206.2(S) ; also sheet 8,9,14,15
FUSED_CELL_1+: R1204.1 R1210.1 T1205.2(S) ; also sheet 8,9,14,15
FUSED_CELL_2+: R1203.1 R1209.1 T1204.2(S) ; also sheet 8,9,14,15
FUSED_CELL_3+: R1202.1 R1208.1 T1203.2(S) ; also sheet 8,9,14,15
FUSED_CELL_4+: R1201.1 R1207.1 T1202.2(S) ; also sheet 8,9,14,15
FUSED_CELL_5+: R1224.1 R1230.1 T1201.2(S) ; also sheet 8,9,14,15
FUSED_CELL_6+: R1223.1 R1229.1 T1212.2(S) ; also sheet 8,9,14,15
FUSED_CELL_7+: R1222.1 R1228.1 T1211.2(S) ; also sheet 8,9,14,15
FUSED_CELL_8+: R1221.1 R1227.1 T1210.2(S) ; also sheet 8,9,14,15
FUSED_CELL_9+: R1220.1 R1226.1 T1209.2(S) ; also sheet 8,9,14,15
FUSED_CELL_10+: R1219.1 R1225.1 T1208.2(S) ; also sheet 8,9,14,15
FUSED_CELL_11+: T1207.2(S) ; also sheet 8,9,15
FUSED_VBAT-: R1206.1 R1212.1 ; also sheet 2,3,4,5,6,7,8,9,10,11,13,14,15,16,17,18
N$32: R1218.1 T1206.1(G)
N$49: R1216.1 T1205.1(G)
N$51: R1217.1 T1204.1(G)
N$54: R1215.1 T1203.1(G)
N$57: R1214.1 T1202.1(G)
N$60: R1213.1 T1201.1(G)
N$63: R1232.1 T1212.1(G)
N$69: R1236.1 T1211.1(G)
N$72: R1235.1 T1210.1(G)
N$75: R1234.1 T1209.1(G)
N$78: R1233.1 T1208.1(G)
N$81: R1231.1 T1207.1(G)
S0: R1218.2 ; also sheet 2
S1: R1216.2 ; also sheet 2
S2: R1217.2 ; also sheet 2
S3: R1215.2 ; also sheet 2
S4: R1214.2 ; also sheet 2
S5: R1213.2 ; also sheet 2
S6: R1232.2 ; also sheet 2
S7: R1236.2 ; also sheet 2
S8: R1235.2 ; also sheet 2
S9: R1234.2 ; also sheet 2
S10: R1233.2 ; also sheet 2
S11: R1231.2 ; also sheet 2

### Notes on the sheet
- Status: A
- Passive Cell Balancing
- Passive cell balancing controlled by primary LTC6804

## Sheet 13 of 18: A/D Inputs Primary LTC6804
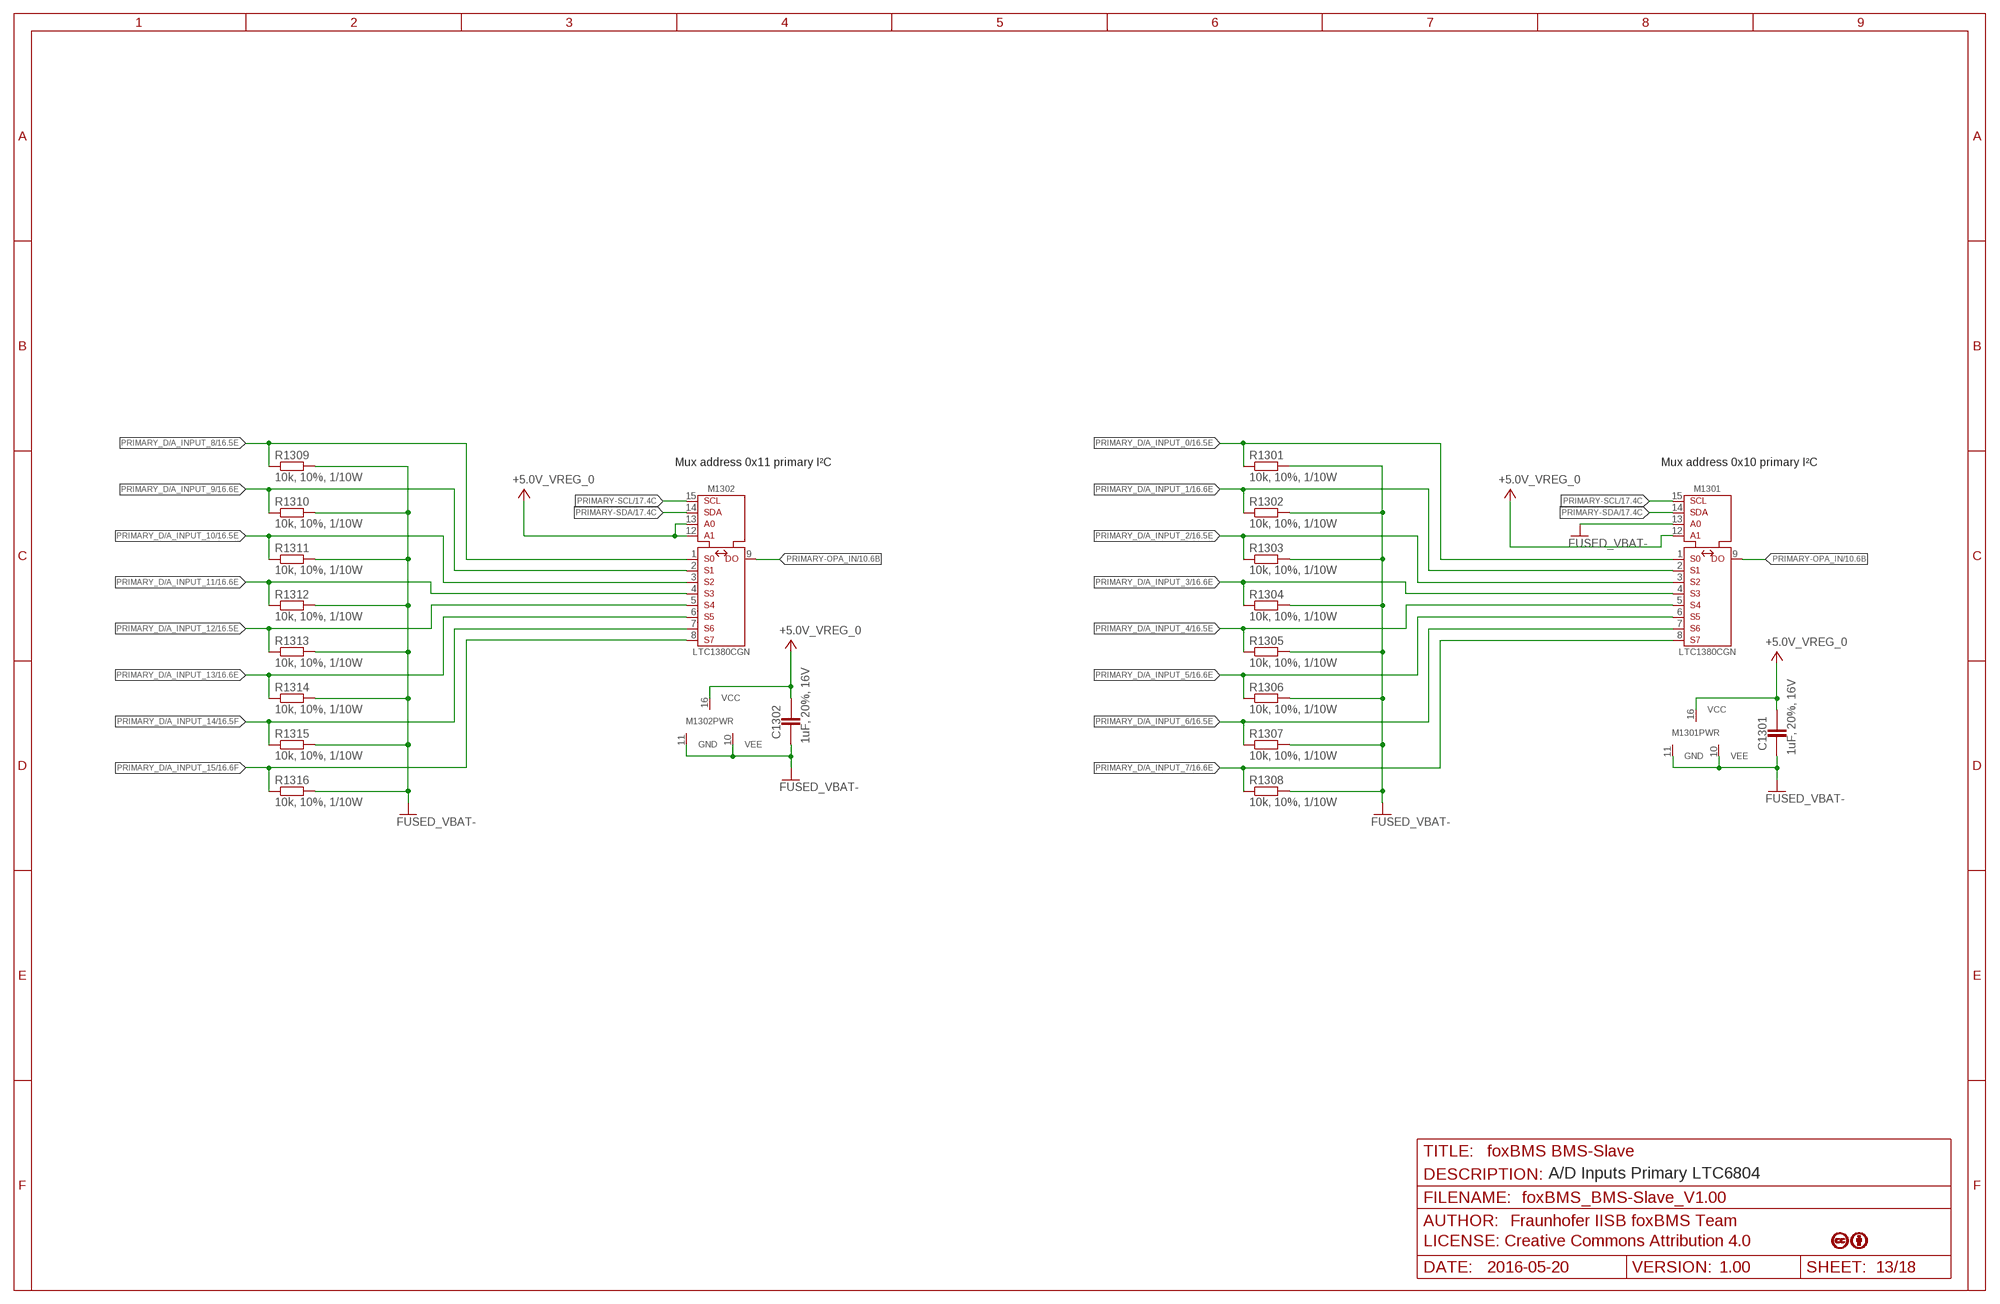
[diagram p13: schematic, sheet 13]

### Parts
C1301  1uF, 20%, 16V  C_NP0_0603  [0603]
C1302  1uF, 20%, 16V  C_NP0_0603  [0603]
M1301  LTC1380CGN  [IC_SMD_SSOP-16_(GN16)_R_LINEAR_REV01]
M1302  LTC1380CGN  [IC_SMD_SSOP-16_(GN16)_R_LINEAR_REV01]
R1301  10k, 10%, 1/10W  R_MET_0603  [0603]
R1302  10k, 10%, 1/10W  R_MET_0603  [0603]
R1303  10k, 10%, 1/10W  R_MET_0603  [0603]
R1304  10k, 10%, 1/10W  R_MET_0603  [0603]
R1305  10k, 10%, 1/10W  R_MET_0603  [0603]
R1306  10k, 10%, 1/10W  R_MET_0603  [0603]
R1307  10k, 10%, 1/10W  R_MET_0603  [0603]
R1308  10k, 10%, 1/10W  R_MET_0603  [0603]
R1309  10k, 10%, 1/10W  R_MET_0603  [0603]
R1310  10k, 10%, 1/10W  R_MET_0603  [0603]
R1311  10k, 10%, 1/10W  R_MET_0603  [0603]
R1312  10k, 10%, 1/10W  R_MET_0603  [0603]
R1313  10k, 10%, 1/10W  R_MET_0603  [0603]
R1314  10k, 10%, 1/10W  R_MET_0603  [0603]
R1315  10k, 10%, 1/10W  R_MET_0603  [0603]
R1316  10k, 10%, 1/10W  R_MET_0603  [0603]

### Nets
+5.0V_VREG_0: C1301.2 C1302.2 M1301.12(A1) M1301.16(VCC) M1302.12(A1) M1302.13(A0) M1302.16(VCC) ; also sheet 2,4,6,10,16,17
FUSED_VBAT-: C1301.1 C1302.1 M1301.10(VEE) M1301.11(GND) M1301.13(A0) M1302.10(VEE) M1302.11(GND) R1301.2 R1302.2 R1303.2 R1304.2 R1305.2 R1306.2 R1307.2 R1308.2 R1309.2 R1310.2 R1311.2 R1312.2 R1313.2 R1314.2 R1315.2 R1316.2 ; also sheet 2,3,4,5,6,7,8,9,10,11,12,14,15,16,17,18
PRIMARY-OPA_IN: M1301.9(DO) M1302.9(DO) ; also sheet 10
PRIMARY-SCL: M1301.15(SCL) M1302.15(SCL) ; also sheet 10,17
PRIMARY-SDA: M1301.14(SDA) M1302.14(SDA) ; also sheet 10,17
PRIMARY_D/A_INPUT_0: M1301.1(S0) R1301.1 ; also sheet 16
PRIMARY_D/A_INPUT_1: M1301.2(S1) R1302.1 ; also sheet 16
PRIMARY_D/A_INPUT_2: M1301.3(S2) R1303.1 ; also sheet 16
PRIMARY_D/A_INPUT_3: M1301.4(S3) R1304.1 ; also sheet 16
PRIMARY_D/A_INPUT_4: M1301.5(S4) R1305.1 ; also sheet 16
PRIMARY_D/A_INPUT_5: M1301.6(S5) R1306.1 ; also sheet 16
PRIMARY_D/A_INPUT_6: M1301.7(S6) R1307.1 ; also sheet 16
PRIMARY_D/A_INPUT_7: M1301.8(S7) R1308.1 ; also sheet 16
PRIMARY_D/A_INPUT_8: M1302.1(S0) R1309.1 ; also sheet 16
PRIMARY_D/A_INPUT_9: M1302.2(S1) R1310.1 ; also sheet 16
PRIMARY_D/A_INPUT_10: M1302.3(S2) R1311.1 ; also sheet 16
PRIMARY_D/A_INPUT_11: M1302.4(S3) R1312.1 ; also sheet 16
PRIMARY_D/A_INPUT_12: M1302.5(S4) R1313.1 ; also sheet 16
PRIMARY_D/A_INPUT_13: M1302.6(S5) R1314.1 ; also sheet 16
PRIMARY_D/A_INPUT_14: M1302.7(S6) R1315.1 ; also sheet 16
PRIMARY_D/A_INPUT_15: M1302.8(S7) R1316.1 ; also sheet 16

### Notes on the sheet
- Mux address 0x11 primary I²C | Mux address 0x10 primary I²C
- A/D Inputs Primary LTC6804 | Status: A

## Sheet 14 of 18: Passive Balacing Feedback
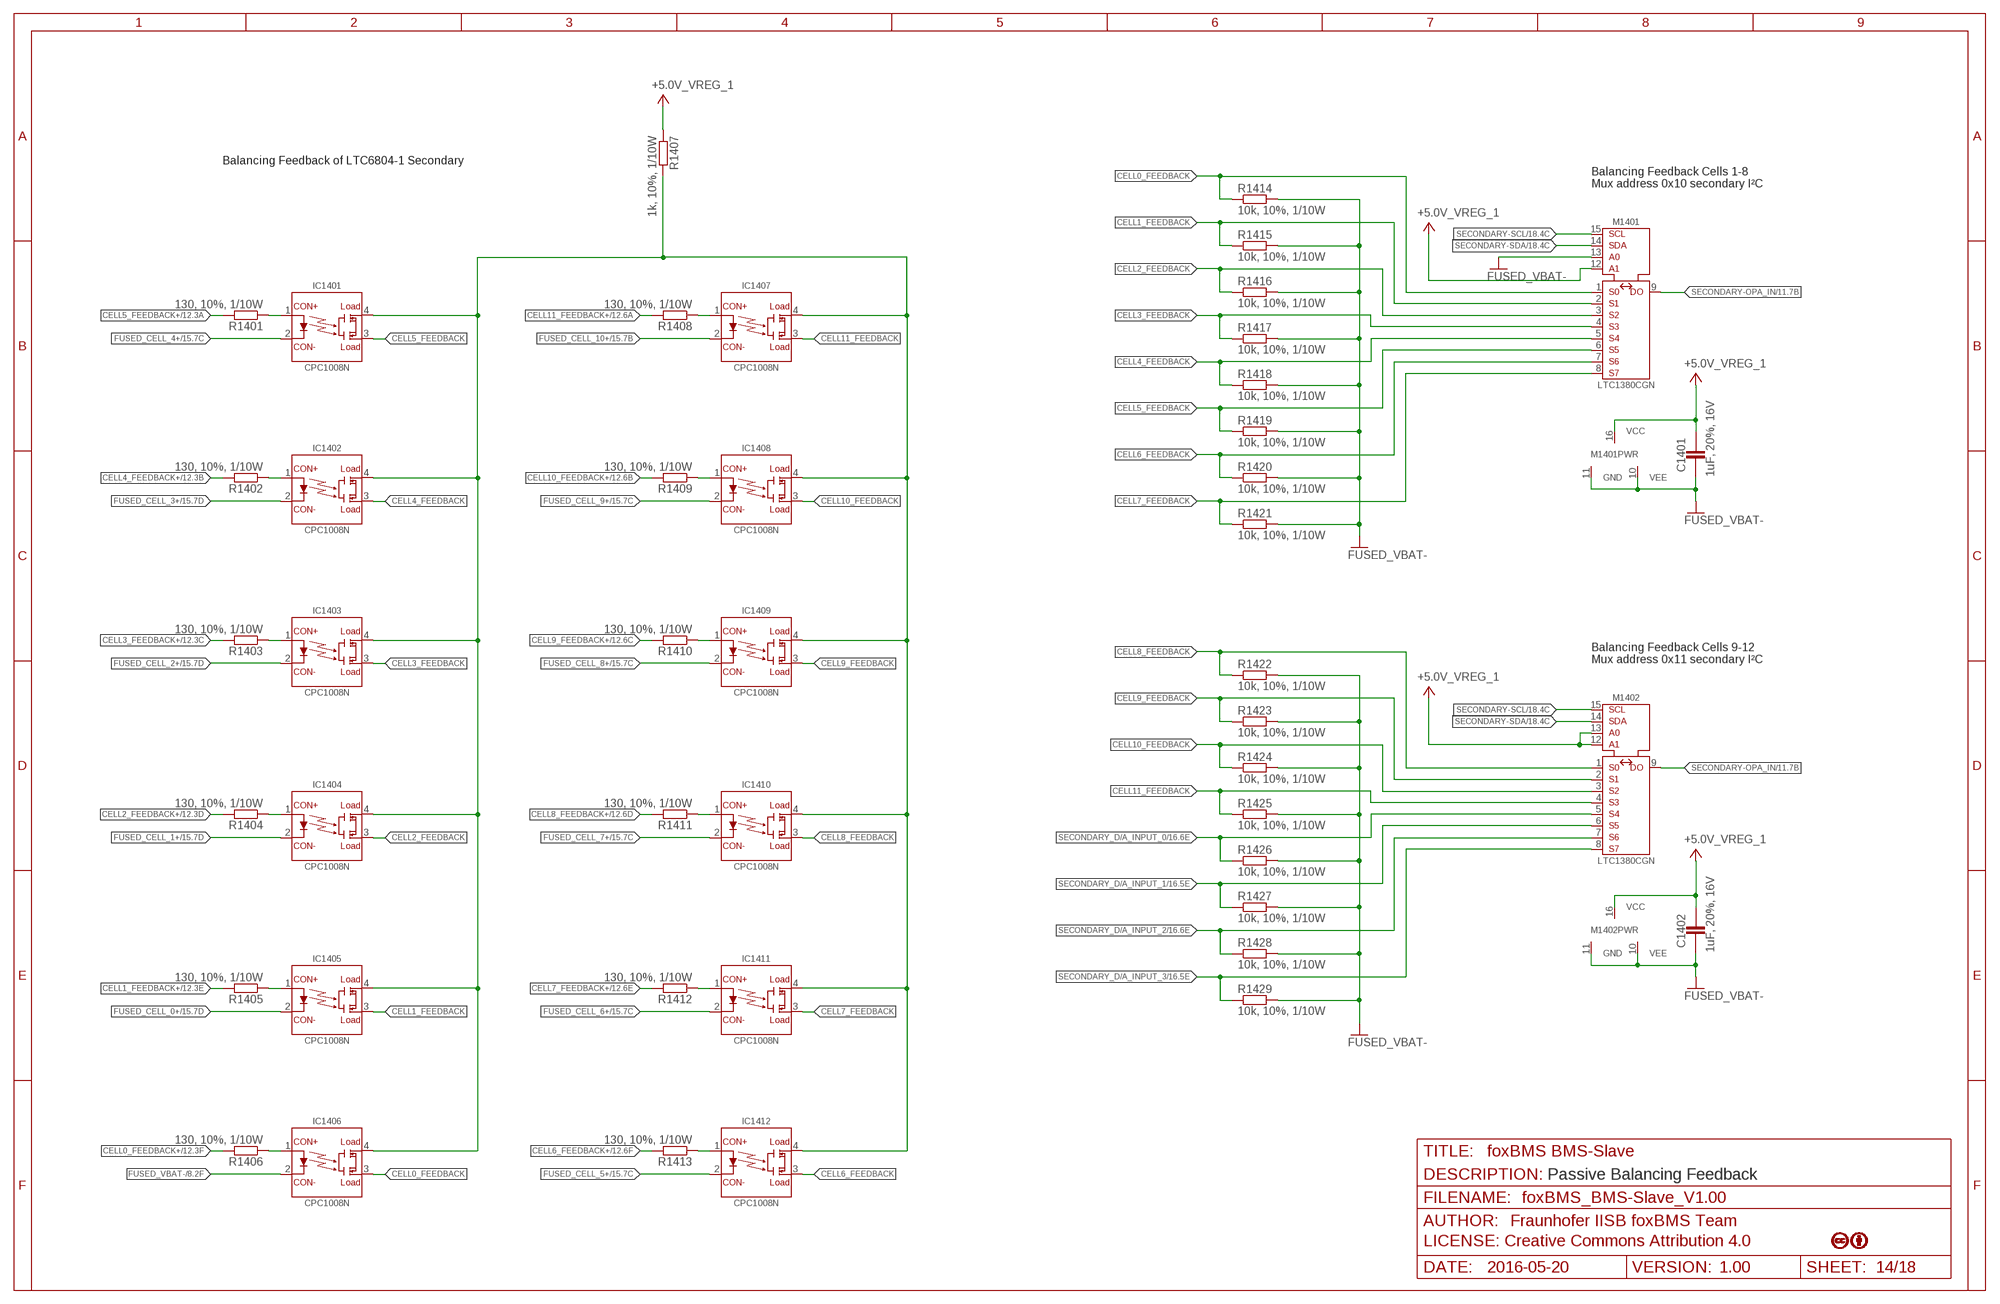
[diagram p14: schematic, sheet 14]

### Parts
C1401  1uF, 20%, 16V  C_NP0_0603  [0603]
C1402  1uF, 20%, 16V  C_NP0_0603  [0603]
IC1401  CPC1008N  [K_SMD_SOP-4_R_IXYS_REV01]
IC1402  CPC1008N  [K_SMD_SOP-4_R_IXYS_REV01]
IC1403  CPC1008N  [K_SMD_SOP-4_R_IXYS_REV01]
IC1404  CPC1008N  [K_SMD_SOP-4_R_IXYS_REV01]
IC1405  CPC1008N  [K_SMD_SOP-4_R_IXYS_REV01]
IC1406  CPC1008N  [K_SMD_SOP-4_R_IXYS_REV01]
IC1407  CPC1008N  [K_SMD_SOP-4_R_IXYS_REV01]
IC1408  CPC1008N  [K_SMD_SOP-4_R_IXYS_REV01]
IC1409  CPC1008N  [K_SMD_SOP-4_R_IXYS_REV01]
IC1410  CPC1008N  [K_SMD_SOP-4_R_IXYS_REV01]
IC1411  CPC1008N  [K_SMD_SOP-4_R_IXYS_REV01]
IC1412  CPC1008N  [K_SMD_SOP-4_R_IXYS_REV01]
M1401  LTC1380CGN  [IC_SMD_SSOP-16_(GN16)_R_LINEAR_REV01]
M1402  LTC1380CGN  [IC_SMD_SSOP-16_(GN16)_R_LINEAR_REV01]
R1401  130, 10%, 1/10W  R_MET_0603  [0603]
R1402  130, 10%, 1/10W  R_MET_0603  [0603]
R1403  130, 10%, 1/10W  R_MET_0603  [0603]
R1404  130, 10%, 1/10W  R_MET_0603  [0603]
R1405  130, 10%, 1/10W  R_MET_0603  [0603]
R1406  130, 10%, 1/10W  R_MET_0603  [0603]
R1407  1k, 10%, 1/10W  R_MET_0603  [0603]
R1408  130, 10%, 1/10W  R_MET_0603  [0603]
R1409  130, 10%, 1/10W  R_MET_0603  [0603]
R1410  130, 10%, 1/10W  R_MET_0603  [0603]
R1411  130, 10%, 1/10W  R_MET_0603  [0603]
R1412  130, 10%, 1/10W  R_MET_0603  [0603]
R1413  130, 10%, 1/10W  R_MET_0603  [0603]
R1414  10k, 10%, 1/10W  R_MET_0603  [0603]
R1415  10k, 10%, 1/10W  R_MET_0603  [0603]
R1416  10k, 10%, 1/10W  R_MET_0603  [0603]
R1417  10k, 10%, 1/10W  R_MET_0603  [0603]
R1418  10k, 10%, 1/10W  R_MET_0603  [0603]
R1419  10k, 10%, 1/10W  R_MET_0603  [0603]
R1420  10k, 10%, 1/10W  R_MET_0603  [0603]
R1421  10k, 10%, 1/10W  R_MET_0603  [0603]
R1422  10k, 10%, 1/10W  R_MET_0603  [0603]
R1423  10k, 10%, 1/10W  R_MET_0603  [0603]
R1424  10k, 10%, 1/10W  R_MET_0603  [0603]
R1425  10k, 10%, 1/10W  R_MET_0603  [0603]
R1426  10k, 10%, 1/10W  R_MET_0603  [0603]
R1427  10k, 10%, 1/10W  R_MET_0603  [0603]
R1428  10k, 10%, 1/10W  R_MET_0603  [0603]
R1429  10k, 10%, 1/10W  R_MET_0603  [0603]

### Nets
+5.0V_VREG_1: C1401.2 C1402.2 M1401.12(A1) M1401.16(VCC) M1402.12(A1) M1402.13(A0) M1402.16(VCC) R1407.1 ; also sheet 3,5,7,11,16,18
CELL0_FEEDBACK: IC1406.3 M1401.1(S0) R1414.1
CELL0_FEEDBACK+: R1406.2 ; also sheet 12
CELL1_FEEDBACK: IC1405.3 M1401.2(S1) R1415.1
CELL1_FEEDBACK+: R1405.2 ; also sheet 12
CELL2_FEEDBACK: IC1404.3 M1401.3(S2) R1416.1
CELL2_FEEDBACK+: R1404.2 ; also sheet 12
CELL3_FEEDBACK: IC1403.3 M1401.4(S3) R1417.1
CELL3_FEEDBACK+: R1403.2 ; also sheet 12
CELL4_FEEDBACK: IC1402.3 M1401.5(S4) R1418.1
CELL4_FEEDBACK+: R1402.2 ; also sheet 12
CELL5_FEEDBACK: IC1401.3 M1401.6(S5) R1419.1
CELL5_FEEDBACK+: R1401.2 ; also sheet 12
CELL6_FEEDBACK: IC1412.3 M1401.7(S6) R1420.1
CELL6_FEEDBACK+: R1413.2 ; also sheet 12
CELL7_FEEDBACK: IC1411.3 M1401.8(S7) R1421.1
CELL7_FEEDBACK+: R1412.2 ; also sheet 12
CELL8_FEEDBACK: IC1410.3 M1402.1(S0) R1422.1
CELL8_FEEDBACK+: R1411.2 ; also sheet 12
CELL9_FEEDBACK: IC1409.3 M1402.2(S1) R1423.1
CELL9_FEEDBACK+: R1410.2 ; also sheet 12
CELL10_FEEDBACK: IC1408.3 M1402.3(S2) R1424.1
CELL10_FEEDBACK+: R1409.2 ; also sheet 12
CELL11_FEEDBACK: IC1407.3 M1402.4(S3) R1425.1
CELL11_FEEDBACK+: R1408.2 ; also sheet 12
FUSED_CELL_0+: IC1405.2(CON-) ; also sheet 8,9,12,15
FUSED_CELL_1+: IC1404.2(CON-) ; also sheet 8,9,12,15
FUSED_CELL_2+: IC1403.2(CON-) ; also sheet 8,9,12,15
FUSED_CELL_3+: IC1402.2(CON-) ; also sheet 8,9,12,15
FUSED_CELL_4+: IC1401.2(CON-) ; also sheet 8,9,12,15
FUSED_CELL_5+: IC1412.2(CON-) ; also sheet 8,9,12,15
FUSED_CELL_6+: IC1411.2(CON-) ; also sheet 8,9,12,15
FUSED_CELL_7+: IC1410.2(CON-) ; also sheet 8,9,12,15
FUSED_CELL_8+: IC1409.2(CON-) ; also sheet 8,9,12,15
FUSED_CELL_9+: IC1408.2(CON-) ; also sheet 8,9,12,15
FUSED_CELL_10+: IC1407.2(CON-) ; also sheet 8,9,12,15
FUSED_VBAT-: C1401.1 C1402.1 IC1406.2(CON-) M1401.10(VEE) M1401.11(GND) M1401.13(A0) M1402.10(VEE) M1402.11(GND) R1414.2 R1415.2 R1416.2 R1417.2 R1418.2 R1419.2 R1420.2 R1421.2 R1422.2 R1423.2 R1424.2 R1425.2 R1426.2 R1427.2 R1428.2 R1429.2 ; also sheet 2,3,4,5,6,7,8,9,10,11,12,13,15,16,17,18
N$50: IC1401.4 IC1402.4 IC1403.4 IC1404.4 IC1405.4 IC1406.4 IC1407.4 IC1408.4 IC1409.4 IC1410.4 IC1411.4 IC1412.4 R1407.2
N$52: IC1402.1(CON+) R1402.1
N$55: IC1403.1(CON+) R1403.1
N$58: IC1404.1(CON+) R1404.1
N$61: IC1408.1(CON+) R1409.1
N$64: IC1409.1(CON+) R1410.1
N$70: IC1405.1(CON+) R1405.1
N$73: IC1407.1(CON+) R1408.1
N$83: IC1410.1(CON+) R1411.1
N$85: IC1411.1(CON+) R1412.1
N$88: IC1406.1(CON+) R1406.1
N$90: IC1412.1(CON+) R1413.1
N$93: IC1401.1(CON+) R1401.1
SECONDARY-OPA_IN: M1401.9(DO) M1402.9(DO) ; also sheet 11
SECONDARY-SCL: M1401.15(SCL) M1402.15(SCL) ; also sheet 11,18
SECONDARY-SDA: M1401.14(SDA) M1402.14(SDA) ; also sheet 11,18
SECONDARY_D/A_INPUT_0: M1402.5(S4) R1426.1 ; also sheet 16
SECONDARY_D/A_INPUT_1: M1402.6(S5) R1427.1 ; also sheet 16
SECONDARY_D/A_INPUT_2: M1402.7(S6) R1428.1 ; also sheet 16
SECONDARY_D/A_INPUT_3: M1402.8(S7) R1429.1 ; also sheet 16

### Notes on the sheet
- Balancing Feedback of LTC6804-1 Secondary
- Balancing Feedback Cells 1-8
  Mux address 0x10 secondary I²C
- Balancing Feedback Cells 9-12
  Mux address 0x11 secondary I²C
- Status: A
- Passive Balancing Feedback

## Sheet 15 of 18: Cell Voltage Sense Fuses
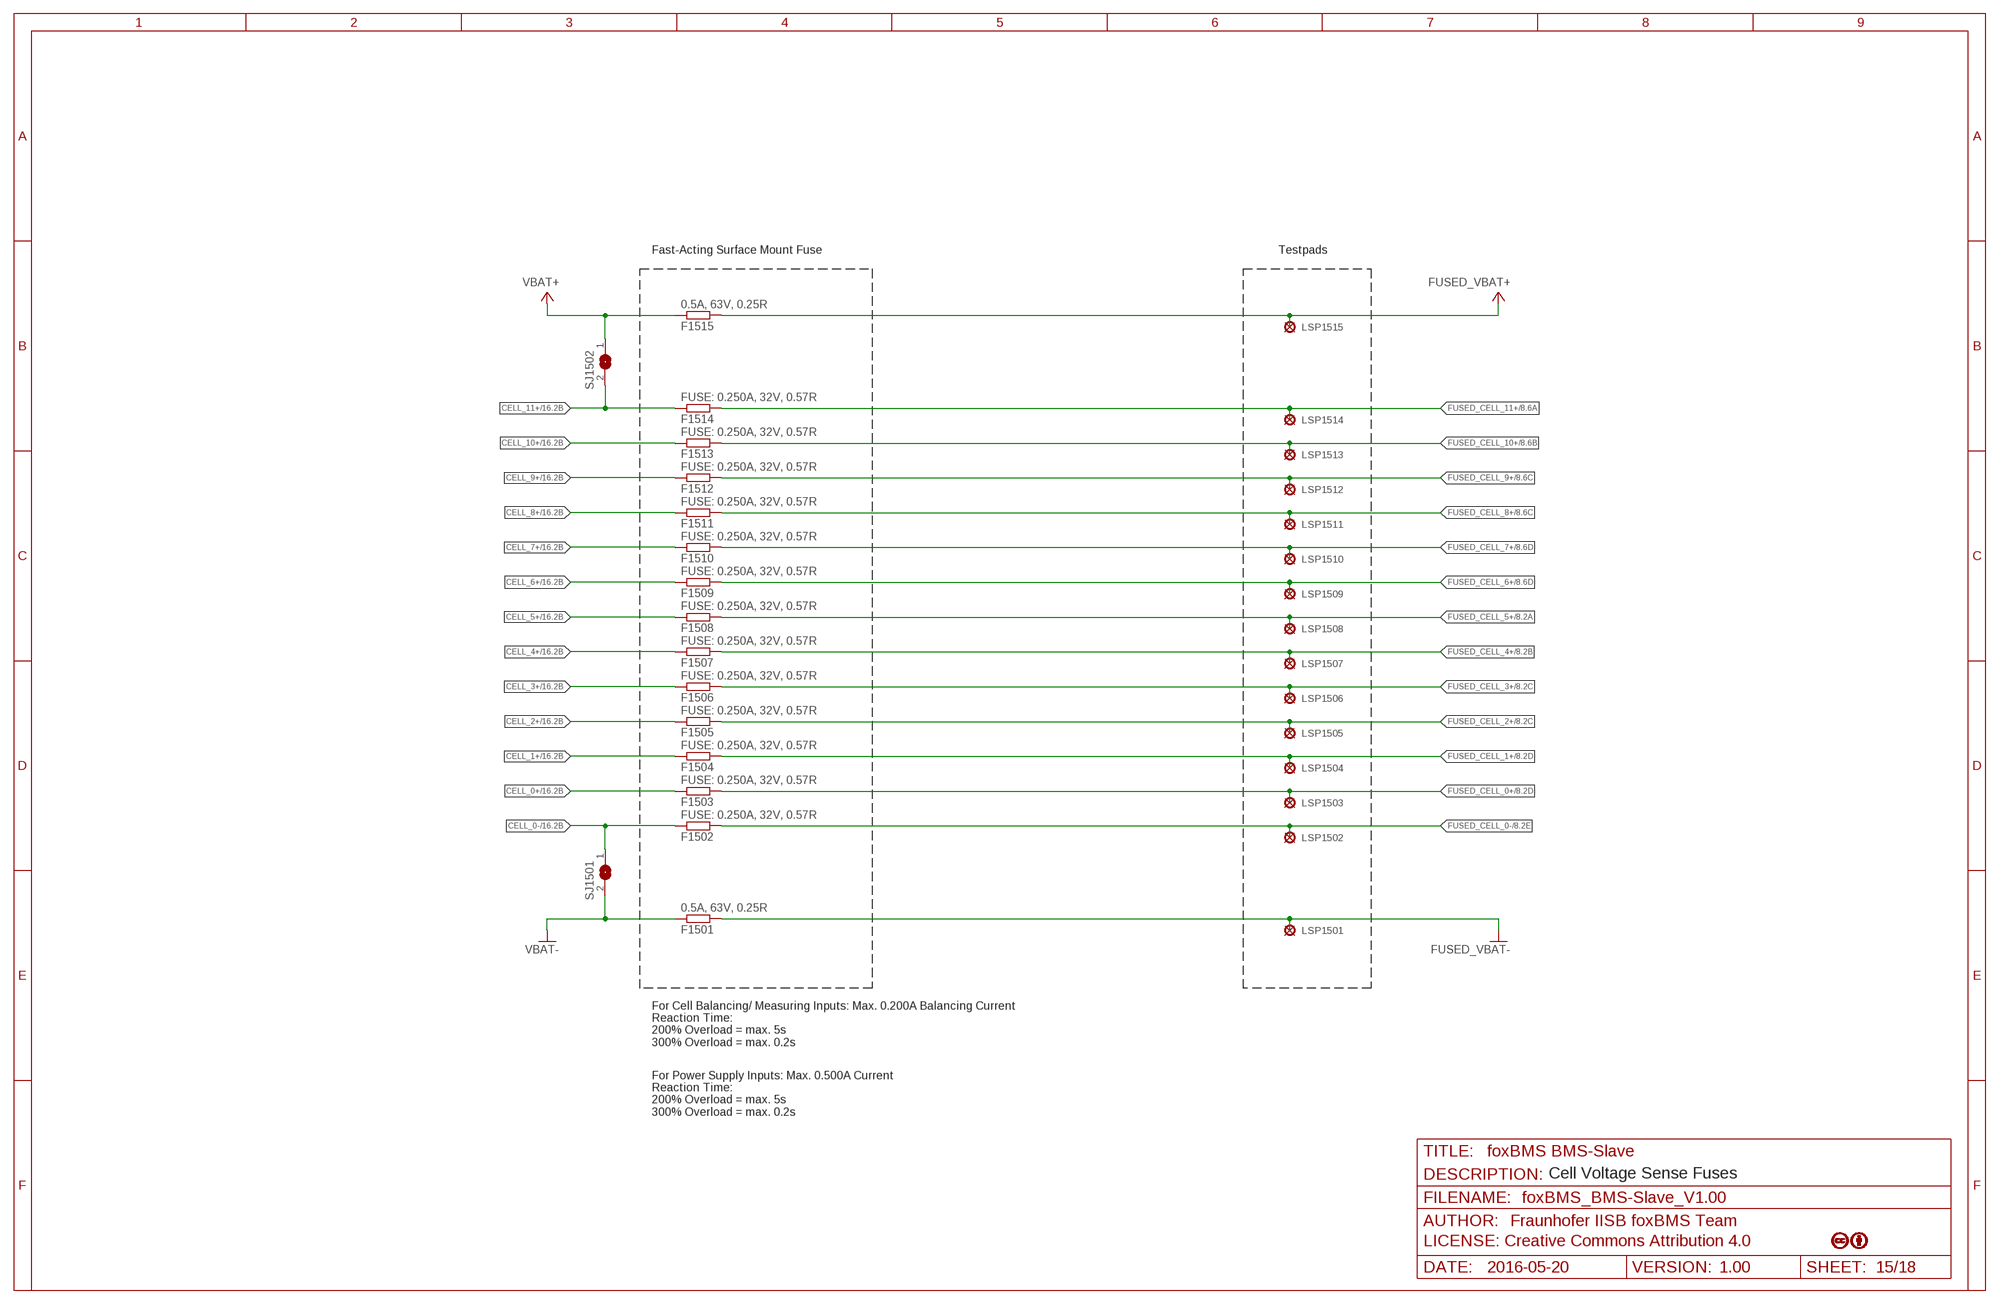
[diagram p15: schematic, sheet 15]

### Parts
F1501  0.5A, 63V, 0.25R  R_MET_1206  [1206]
F1502  FUSE: 0.250A, 32V, 0.57R  R_MET_0603  [0603]
F1503  FUSE: 0.250A, 32V, 0.57R  R_MET_0603  [0603]
F1504  FUSE: 0.250A, 32V, 0.57R  R_MET_0603  [0603]
F1505  FUSE: 0.250A, 32V, 0.57R  R_MET_0603  [0603]
F1506  FUSE: 0.250A, 32V, 0.57R  R_MET_0603  [0603]
F1507  FUSE: 0.250A, 32V, 0.57R  R_MET_0603  [0603]
F1508  FUSE: 0.250A, 32V, 0.57R  R_MET_0603  [0603]
F1509  FUSE: 0.250A, 32V, 0.57R  R_MET_0603  [0603]
F1510  FUSE: 0.250A, 32V, 0.57R  R_MET_0603  [0603]
F1511  FUSE: 0.250A, 32V, 0.57R  R_MET_0603  [0603]
F1512  FUSE: 0.250A, 32V, 0.57R  R_MET_0603  [0603]
F1513  FUSE: 0.250A, 32V, 0.57R  R_MET_0603  [0603]
F1514  FUSE: 0.250A, 32V, 0.57R  R_MET_0603  [0603]
F1515  0.5A, 63V, 0.25R  R_MET_1206  [1206]
LSP1501  PAD_2.0X1.5MM  [PAD2.0X1.5MM]
LSP1502  PAD_2.0X1.5MM  [PAD2.0X1.5MM]
LSP1503  PAD_2.0X1.5MM  [PAD2.0X1.5MM]
LSP1504  PAD_2.0X1.5MM  [PAD2.0X1.5MM]
LSP1505  PAD_2.0X1.5MM  [PAD2.0X1.5MM]
LSP1506  PAD_2.0X1.5MM  [PAD2.0X1.5MM]
LSP1507  PAD_2.0X1.5MM  [PAD2.0X1.5MM]
LSP1508  PAD_2.0X1.5MM  [PAD2.0X1.5MM]
LSP1509  PAD_2.0X1.5MM  [PAD2.0X1.5MM]
LSP1510  PAD_2.0X1.5MM  [PAD2.0X1.5MM]
LSP1511  PAD_2.0X1.5MM  [PAD2.0X1.5MM]
LSP1512  PAD_2.0X1.5MM  [PAD2.0X1.5MM]
LSP1513  PAD_2.0X1.5MM  [PAD2.0X1.5MM]
LSP1514  PAD_2.0X1.5MM  [PAD2.0X1.5MM]
LSP1515  PAD_2.0X1.5MM  [PAD2.0X1.5MM]
SJ1501  SJ  [SJ]
SJ1502  SJ  [SJ]

### Nets
CELL_0+: F1503.1 ; also sheet 16
CELL_0-: F1502.1 SJ1501.1 ; also sheet 16
CELL_1+: F1504.1 ; also sheet 16
CELL_2+: F1505.1 ; also sheet 16
CELL_3+: F1506.1 ; also sheet 16
CELL_4+: F1507.1 ; also sheet 16
CELL_5+: F1508.1 ; also sheet 16
CELL_6+: F1509.1 ; also sheet 16
CELL_7+: F1510.1 ; also sheet 16
CELL_8+: F1511.1 ; also sheet 16
CELL_9+: F1512.1 ; also sheet 16
CELL_10+: F1513.1 ; also sheet 16
CELL_11+: F1514.1 SJ1502.2 ; also sheet 16
FUSED_CELL_0+: F1503.2 LSP1503.P$1(MP) ; also sheet 8,9,12,14
FUSED_CELL_0-: F1502.2 LSP1502.P$1(MP) ; also sheet 8,9
FUSED_CELL_1+: F1504.2 LSP1504.P$1(MP) ; also sheet 8,9,12,14
FUSED_CELL_2+: F1505.2 LSP1505.P$1(MP) ; also sheet 8,9,12,14
FUSED_CELL_3+: F1506.2 LSP1506.P$1(MP) ; also sheet 8,9,12,14
FUSED_CELL_4+: F1507.2 LSP1507.P$1(MP) ; also sheet 8,9,12,14
FUSED_CELL_5+: F1508.2 LSP1508.P$1(MP) ; also sheet 8,9,12,14
FUSED_CELL_6+: F1509.2 LSP1509.P$1(MP) ; also sheet 8,9,12,14
FUSED_CELL_7+: F1510.2 LSP1510.P$1(MP) ; also sheet 8,9,12,14
FUSED_CELL_8+: F1511.2 LSP1511.P$1(MP) ; also sheet 8,9,12,14
FUSED_CELL_9+: F1512.2 LSP1512.P$1(MP) ; also sheet 8,9,12,14
FUSED_CELL_10+: F1513.2 LSP1513.P$1(MP) ; also sheet 8,9,12,14
FUSED_CELL_11+: F1514.2 LSP1514.P$1(MP) ; also sheet 8,9,12
FUSED_VBAT+: F1515.2 LSP1515.P$1(MP) ; also sheet 4,5
FUSED_VBAT-: F1501.2 LSP1501.P$1(MP) ; also sheet 2,3,4,5,6,7,8,9,10,11,12,13,14,16,17,18
VBAT+: F1515.1 SJ1502.1 ; also sheet 16
VBAT-: F1501.1 SJ1501.2 ; also sheet 16

### Notes on the sheet
- Fast-Acting Surface Mount Fuse | Testpads
- For Cell Balancing/ Measuring Inputs: Max. 0.200A Balancing Current 
  Reaction Time: 
  200% Overload = max. 5s
  300% Overload = max. 0.2s
- For Power Supply Inputs: Max. 0.500A Current 
  Reaction Time:
  200% Overload = max. 5s
  300% Overload = max. 0.2s
- Cell Voltage Sense Fuses